# EAGLE design NFT-v1.1 (EAGLE 7.7.0)

## Sheet 1 of 5
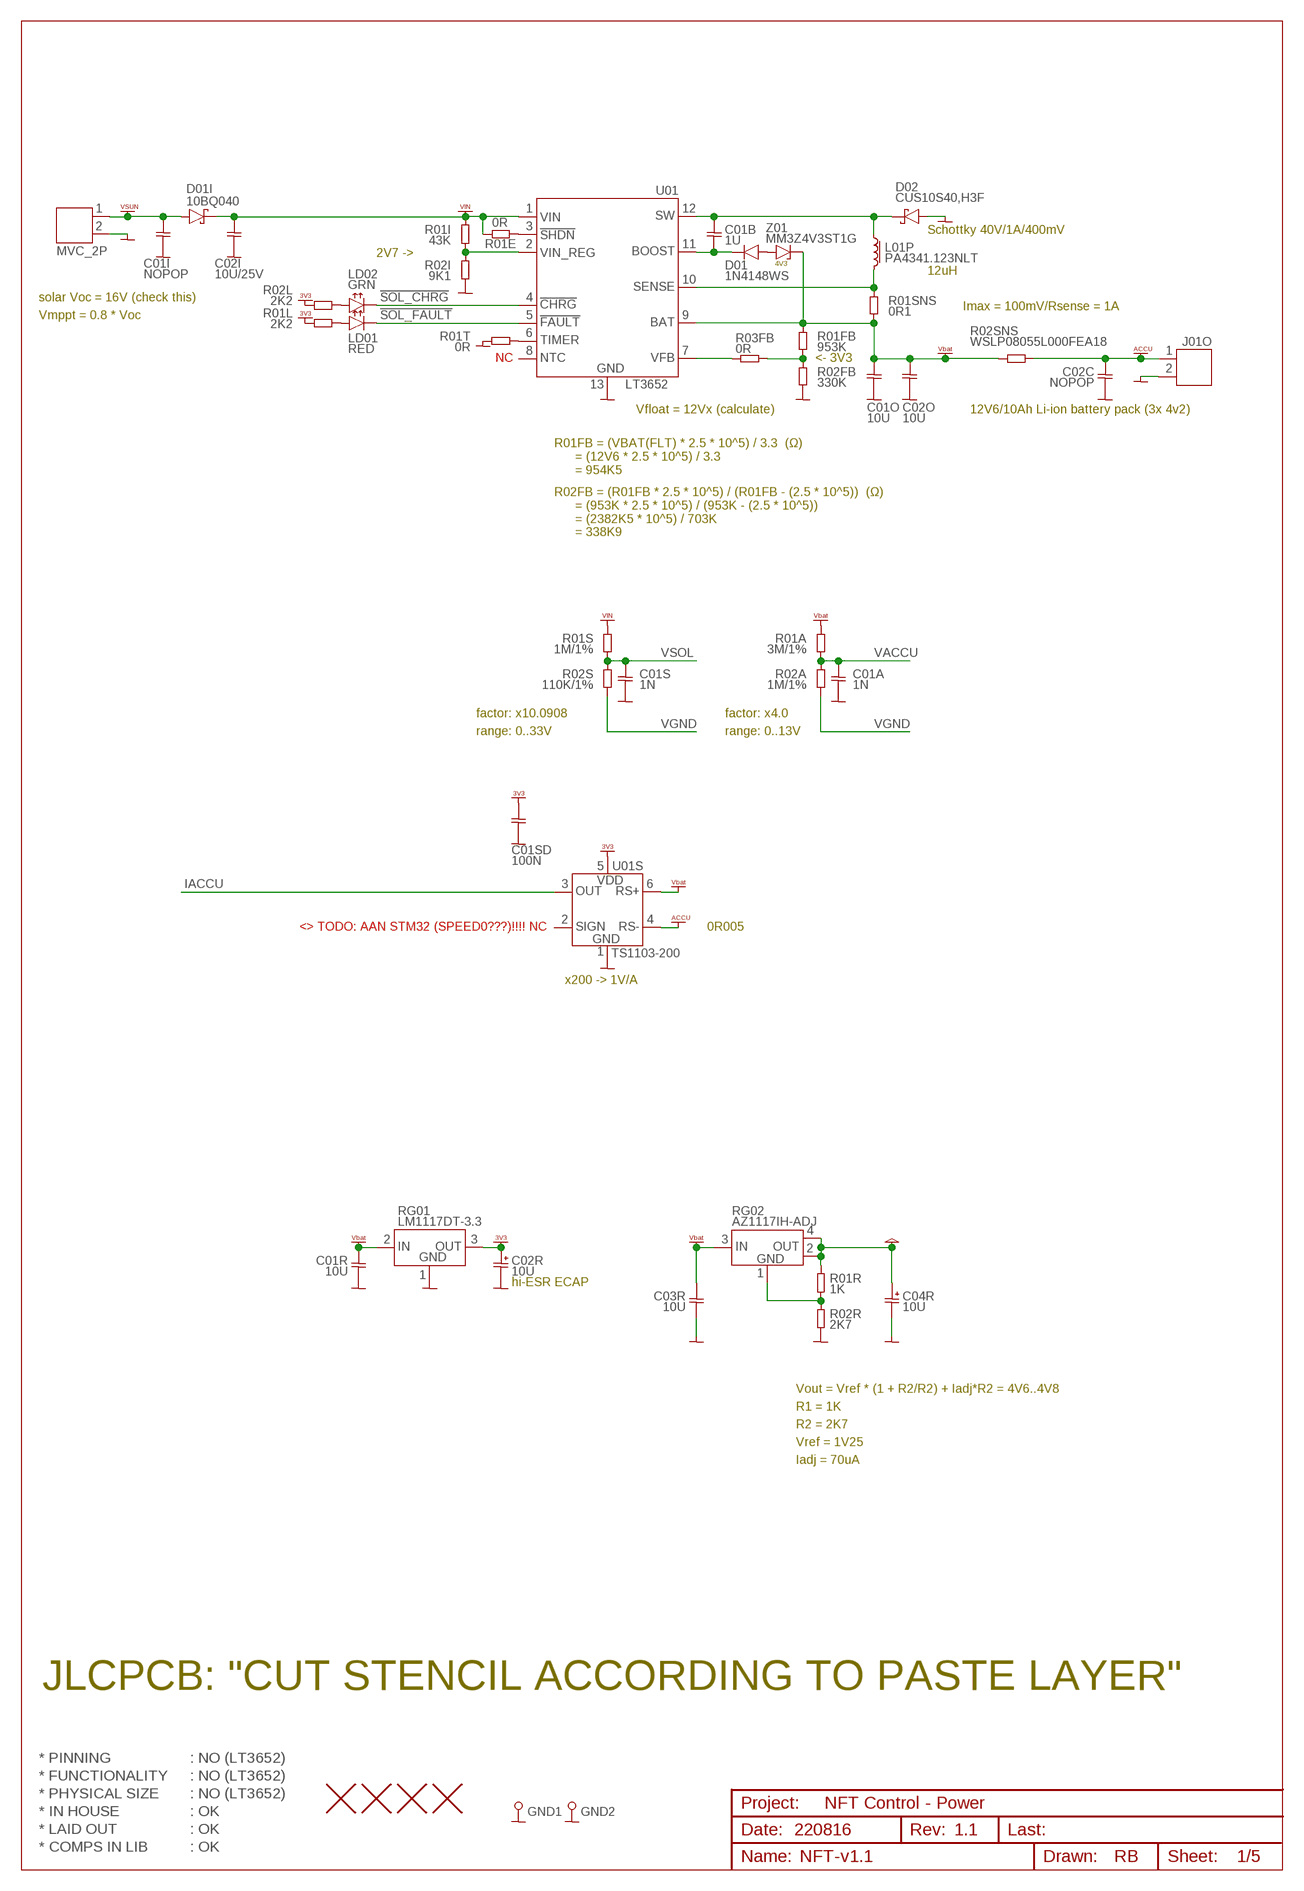
[diagram p0: schematic, sheet 1]

### Parts
C01A  1N  CAP0402  [CAP0402]
C01B  1U  CAP0402  [CAP0402]
C01I  NOPOP  CAP1812  [CAP1812]
C01O  10U  CAP0805  [CAP0805]
C01R  10U  CAP0603  [CAP0603]
C01S  1N  CAP0402  [CAP0402]
C01SD  100N  CAP0402  [CAP0402]
C02C  NOPOP  CAP1812  [CAP1812]
C02I  10U/25V  CAP0805  [CAP0805]
C02O  10U  CAP0805  [CAP0805]
C02R  10U  ECAP_SMA  [ECAP_SMA]
C03R  10U  CAP0603  [CAP0603]
C04R  10U  ECAP_SMA  [ECAP_SMA]
D01  1N4148WS  DIODE_1N4148WS  [DIODE_SOD323]
D01I  10BQ040  DIODE_10BQ030  [DIODE_SMB]
D02  CUS10S40,H3F  DIODE_SCHOTTKY_SOD323  [DIODE_SOD323]
GND1  PIN_TEST  [HOLE_PTH_0.8MM]
GND2  PIN_TEST  [HOLE_PTH_0.8MM]
H1  HOLE_NPTH_3.2MM  [HOLE_NPTH_3.2MM]
H2  HOLE_NPTH_3.2MM  [HOLE_NPTH_3.2MM]
H3  HOLE_NPTH_3.2MM  [HOLE_NPTH_3.2MM]
H4  HOLE_NPTH_3.2MM  [HOLE_NPTH_3.2MM]
J01I  MVC_2P  CON_PHOENIX_COMBICON_MCV_HEADER_2P  [CON_PHOENIX_COMBICON_MCV_HEADER_P]
J01O  CON_PHOENIX_COMBICON_MCV_HEADER_2P  [CON_PHOENIX_COMBICON_MCV_HEADER_P]
L01P  PA4341.123NLT  L_PA4341  [L_PA4341]
LD01  RED  LED_SMD_0402  [LED_SMD_0402]
LD02  GRN  LED_SMD_0402  [LED_SMD_0402]
R01A  3M/1%  RES0402  [RES0402]
R01E  0R  RES0402  [RES0402]
R01FB  953K  RES0402  [RES0402]
R01I  43K  RES0402  [RES0402]
R01L  2K2  RES0402  [RES0402]
R01R  1K  RES0402  [RES0402]
R01S  1M/1%  RES0402  [RES0402]
R01SNS  0R1  RES0603  [RES0603]
R01T  0R  RES0402  [RES0402]
R02A  1M/1%  RES0402  [RES0402]
R02FB  330K  RES0402  [RES0402]
R02I  9K1  RES0402  [RES0402]
R02L  2K2  RES0402  [RES0402]
R02R  2K7  RES0402  [RES0402]
R02S  110K/1%  RES0402  [RES0402]
R02SNS  WSLP08055L000FEA18  RES0805  [RES0805]
R03FB  0R  RES0402  [RES0402]
RG01  LM1117DT-3.3  [TO252]
RG02  AZ1117IH-ADJ  [SOT223]
U01  LT3652  [MSOP-12_GND]
U01S  TS1103-200  [SOT23-6]
Z01  MM3Z4V3ST1G  ZENER_SOD323  [ZENER_SOD323]

### Nets
!SOL_CHRG: LD02.C U01.4(4.!CHRG) ; also sheet 2
!SOL_FAULT: LD01.C U01.5(5.!FAULT)
ACCU: C02C.1 J01O.1 R02SNS.2 U01S.4(4.RS-) ; supply symbol labelled VACCU
BOOST: C01B.2 D01.C(-) U01.11(11.BOOST)
FB1: R01R.2 R02R.1 RG02.1(1.GND)
GND: C01A.2 C01I.2 C01O.2 C01R.2 C01S.2 C01SD.2 C02C.2 C02I.2 C02O.2 C02R.- C03R.2 C04R.- D02.A GND1.1 GND2.1 J01I.2 J01O.2 R01T.2 R02FB.1 R02I.1 R02R.2 RG01.1(1.GND) U01.13(GND_PAD) U01S.1(1.GND) ; also sheet 2,3,4,5
IACCU: U01S.3(3.OUT) ; also sheet 2
N$4: R03FB.2 U01.7(7.VFB)
N$5: LD01.A R01L.2
N$10: LD02.A R02L.2
N$25: R01T.1 U01.6(6.TIMER)
N$26: D01.A(+) Z01.A
N$27: R01E.1 U01.3(3.!SHDN)
SENSE: L01P.P$2 R01SNS.2 U01.10(10.SENSE)
SW: C01B.1 D02.C L01P.P$1 U01.12(12.SW)
VACCU: C01A.1 R01A.1 R02A.2 ; also sheet 2
VBAT: C01O.1 C01R.1 C02O.1 C03R.1 R01A.2 R01FB.2 R01SNS.1 R02SNS.1 RG01.2(2.IN) RG02.3(3.IN) U01.9(9.BAT) U01S.6(6.RS+) Z01.C ; also sheet 5
VCC: C04R.+ R01R.1 RG02.2(2.OUT) RG02.4(4.OUT) ; also sheet 5
VDD_3V3: C01SD.1 C02R.+ R01L.1 R02L.1 RG01.3(3.OUT) U01S.5(5.VDD) ; supply symbol labelled VCC_3V3 ; also sheet 2,3,4
VFB: R01FB.1 R02FB.2 R03FB.1
VGND: R02A.1 R02S.1 ; also sheet 2
VIN: C02I.1 D01I.C(-) R01E.2 R01I.2 R01S.2 U01.1(1.VIN)
VIN_REG: R01I.1 R02I.2 U01.2(2.VIN_REG)
VSOL: C01S.1 R01S.1 R02S.2 ; also sheet 2
VSUN: C01I.1 D01I.A(+) J01I.1
Unconnected: U01.8(8.NTC) U01S.2(2.SIGN)

### Notes on the sheet
- Schottky 40V/1A/400mV
- 2V7 ->
- 4V3
- 12uH
- solar Voc = 16V (check this)
- Imax = 100mV/Rsense = 1A
- Vmppt = 0.8 * Voc
- NC | <- 3V3
- Vfloat = 12Vx (calculate) | 12V6/10Ah Li-ion battery pack (3x 4v2)
- R01FB = (VBAT(FLT) * 2.5 * 10^5) / 3.3  (Ω)
        = (12V6 * 2.5 * 10^5) / 3.3
        = 954K5
- R02FB = (R01FB * 2.5 * 10^5) / (R01FB - (2.5 * 10^5))  (Ω)
        = (953K * 2.5 * 10^5) / (953K - (2.5 * 10^5))
        = (2382K5 * 10^5) / 703K
        = 338K9
- factor: x10.0908 | factor: x4.0
- range: 0..33V | range: 0..13V
- <> TODO: AAN STM32 (SPEED0???)!!!! NC | 0R005
- x200 -> 1V/A
- hi-ESR ECAP
- Vout = Vref * (1 + R2/R2) + Iadj*R2 = 4V6..4V8
- R1 = 1K
- R2 = 2K7
- Vref = 1V25
- Iadj = 70uA
- JLCPCB: "CUT STENCIL ACCORDING TO PASTE LAYER"
- * PINNING | : NO (LT3652)
- * FUNCTIONALITY | : NO (LT3652)
- * PHYSICAL SIZE | : NO (LT3652)
- NFT Control - Power
- * IN HOUSE | : OK
- * LAID OUT | : OK | 220816 | 1.1
- * COMPS IN LIB | : OK

## Sheet 2 of 5
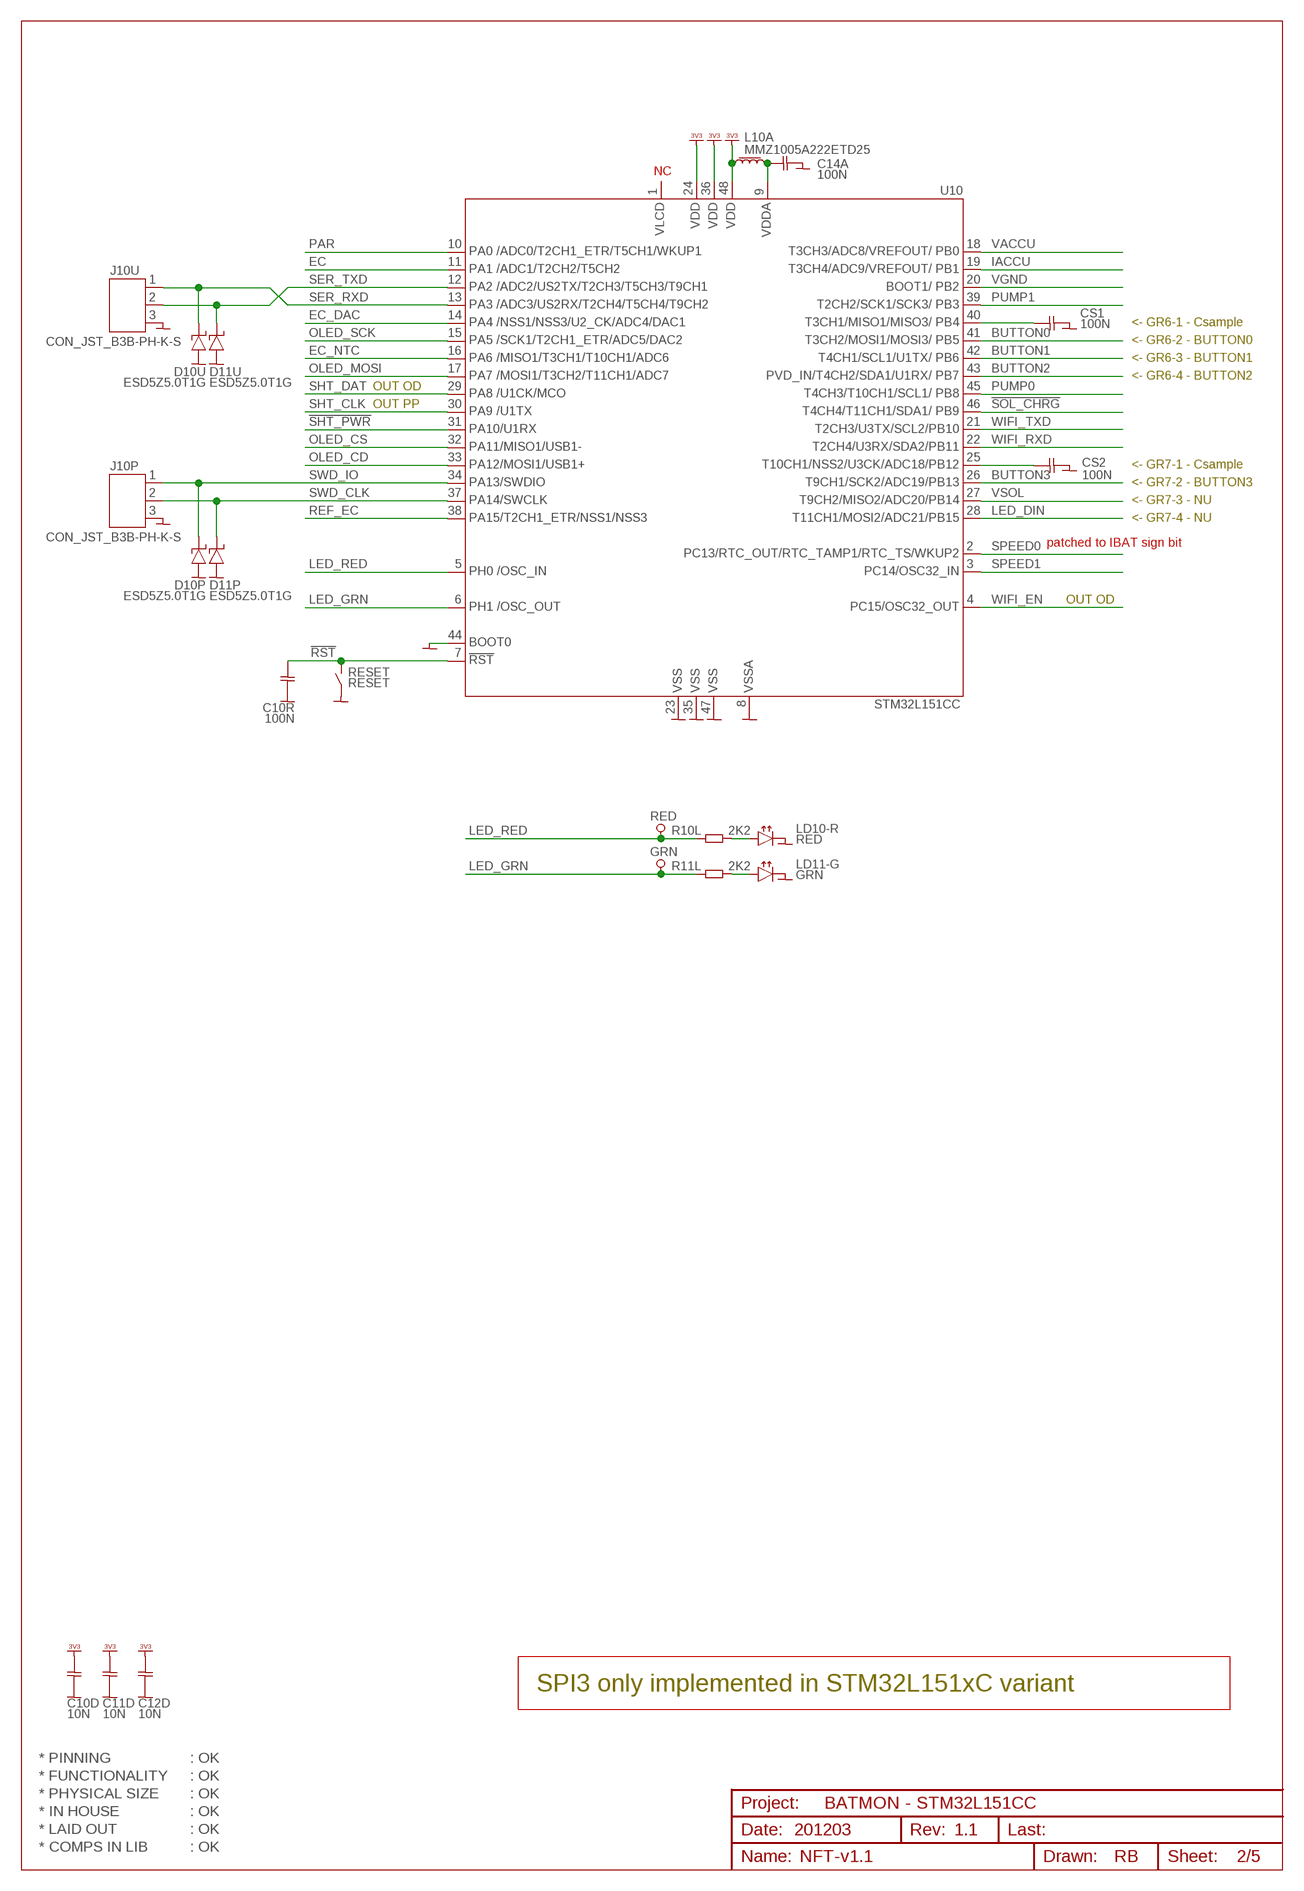
[diagram p1: schematic, sheet 2]

### Parts
C10D  10N  CAP0402  [CAP0402]
C10R  100N  CAP0402  [CAP0402]
C11D  10N  CAP0402  [CAP0402]
C12D  10N  CAP0402  [CAP0402]
C14A  100N  CAP0402  [CAP0402]
CS1  100N  CAP0402  [CAP0402]
CS2  100N  CAP0402  [CAP0402]
D10P  ESD5Z5.0T1G  DIODE_TVS_SOD523  [DIODE_SOD523]
D10U  ESD5Z5.0T1G  DIODE_TVS_SOD523  [DIODE_SOD523]
D11P  ESD5Z5.0T1G  DIODE_TVS_SOD523  [DIODE_SOD523]
D11U  ESD5Z5.0T1G  DIODE_TVS_SOD523  [DIODE_SOD523]
GRN  PIN_TEST_0.6MM  [HOLE_PTH_0.6MM]
J10P  CON_JST_B3B-PH-K-S  [CON_JST_B3B-PH-K-S]
J10U  CON_JST_B3B-PH-K-S  [CON_JST_B3B-PH-K-S]
L10A  MMZ1005A222ETD25  L_0402_LOSSY  [L_0402]
LD10-R  RED  LED_SMD_0402  [LED_SMD_0402]
LD11-G  GRN  LED_SMD_0402  [LED_SMD_0402]
R10L  2K2  RES0402  [RES0402]
R11L  2K2  RES0402  [RES0402]
RED  PIN_TEST_0.6MM  [HOLE_PTH_0.6MM]
RESET  RESET  SWITCH_PUSHBUTTON  [SWITCH_SMD_PBUTTON_2P]
U10  STM32L151CC  [LQFP48]

### Nets
!RST: C10R.1 RESET.1(1-2) U10.7(7.!RST)
!SHT_PWR: U10.31(31.PA10) ; also sheet 4
!SOL_CHRG: U10.46(46.PB9) ; also sheet 1
BUTTON0: U10.41(41.PB5) ; also sheet 3
BUTTON1: U10.42(42.PB6) ; also sheet 3
BUTTON2: U10.43(43.PB7) ; also sheet 3
BUTTON3: U10.26(26.PB13) ; also sheet 3
CSAMPLE: CS1.1 U10.40(40.PB4)
CSAMPLE1: CS2.1 U10.25(25.PB12)
EC: U10.11(11.PA1) ; also sheet 4
EC_DAC: U10.14(14.PA4) ; also sheet 4
EC_NTC: U10.16(16.PA6) ; also sheet 4
GND: C10D.2 C10R.2 C11D.2 C12D.2 C14A.2 CS1.2 CS2.2 D10P.A D10U.A D11P.A D11U.A J10P.3 J10U.3 LD10-R.C LD11-G.C RESET.2(3-4) U10.8(8.GND) U10.23(23.GND) U10.35(35.GND) U10.44(44.BOOT0) U10.47(47.GND) ; also sheet 1,3,4,5
IACCU: U10.19(19.PB1) ; also sheet 1
LED_DIN: U10.28(28.PB15) ; also sheet 5
LED_GRN: GRN.1 R11L.1 U10.6(6.OSC_OUT)
LED_RED: R10L.1 RED.1 U10.5(5.OSC_IN)
N$23: LD11-G.A R11L.2
N$39: LD10-R.A R10L.2
OLED_CD: U10.33(33.PA12) ; also sheet 3
OLED_CS: U10.32(32.PA11) ; also sheet 3
OLED_MOSI: U10.17(17.PA7) ; also sheet 3
OLED_SCK: U10.15(15.PA5) ; also sheet 3
PAR: U10.10(10.PA0) ; also sheet 4
PUMP0: U10.45(45.PB8) ; also sheet 5
PUMP1: U10.39(39.PB3) ; also sheet 5
REF_EC: U10.38(38.PA15) ; also sheet 4
SER_RXD: D10U.C J10U.1 U10.13(13.PA3)
SER_TXD: D11U.C J10U.2 U10.12(12.PA2)
SHT_CLK: U10.30(30.PA9) ; also sheet 4
SHT_DAT: U10.29(29.PA8) ; also sheet 4
SPEED0: U10.2(2.PC13) ; also sheet 5
SPEED1: U10.3(3.PC14) ; also sheet 5
SWD_CLK: D11P.C J10P.2 U10.37(37.PA14)
SWD_IO: D10P.C J10P.1 U10.34(34.PA13)
VACCU: U10.18(18.PB0) ; also sheet 1
VDD_3V3: C10D.1 C11D.1 C12D.1 L10A.1 U10.24(24.VDD) U10.36(36.VDD) U10.48(48.VDD) ; supply symbol labelled VCC_3V3 ; also sheet 1,3,4
VDDA: C14A.1 L10A.2 U10.9(9.VDD)
VGND: U10.20(20.PB2) ; also sheet 1
VSOL: U10.27(27.PB14) ; also sheet 1
WIFI_EN: U10.4(4.PC15) ; also sheet 3
WIFI_RXD: U10.22(22.PB11) ; also sheet 3
WIFI_TXD: U10.21(21.PB10) ; also sheet 3
Unconnected: U10.1(1.VDD)

### Notes on the sheet
- NC
- <- GR6-1 - Csample
- <- GR6-2 - BUTTON0
- <- GR6-3 - BUTTON1
- <- GR6-4 - BUTTON2
- OUT OD
- OUT PP
- <- GR7-1 - Csample
- <- GR7-2 - BUTTON3
- <- GR7-3 - NU
- <- GR7-4 - NU
- patched to IBAT sign bit
- OUT OD
- SPI3 only implemented in STM32L151xC variant
- * PINNING | : OK
- * FUNCTIONALITY | : OK
- * PHYSICAL SIZE | : OK
- BATMON - STM32L151CC
- * IN HOUSE | : OK
- * LAID OUT | : OK | 201203 | 1.1
- * COMPS IN LIB | : OK

## Sheet 3 of 5
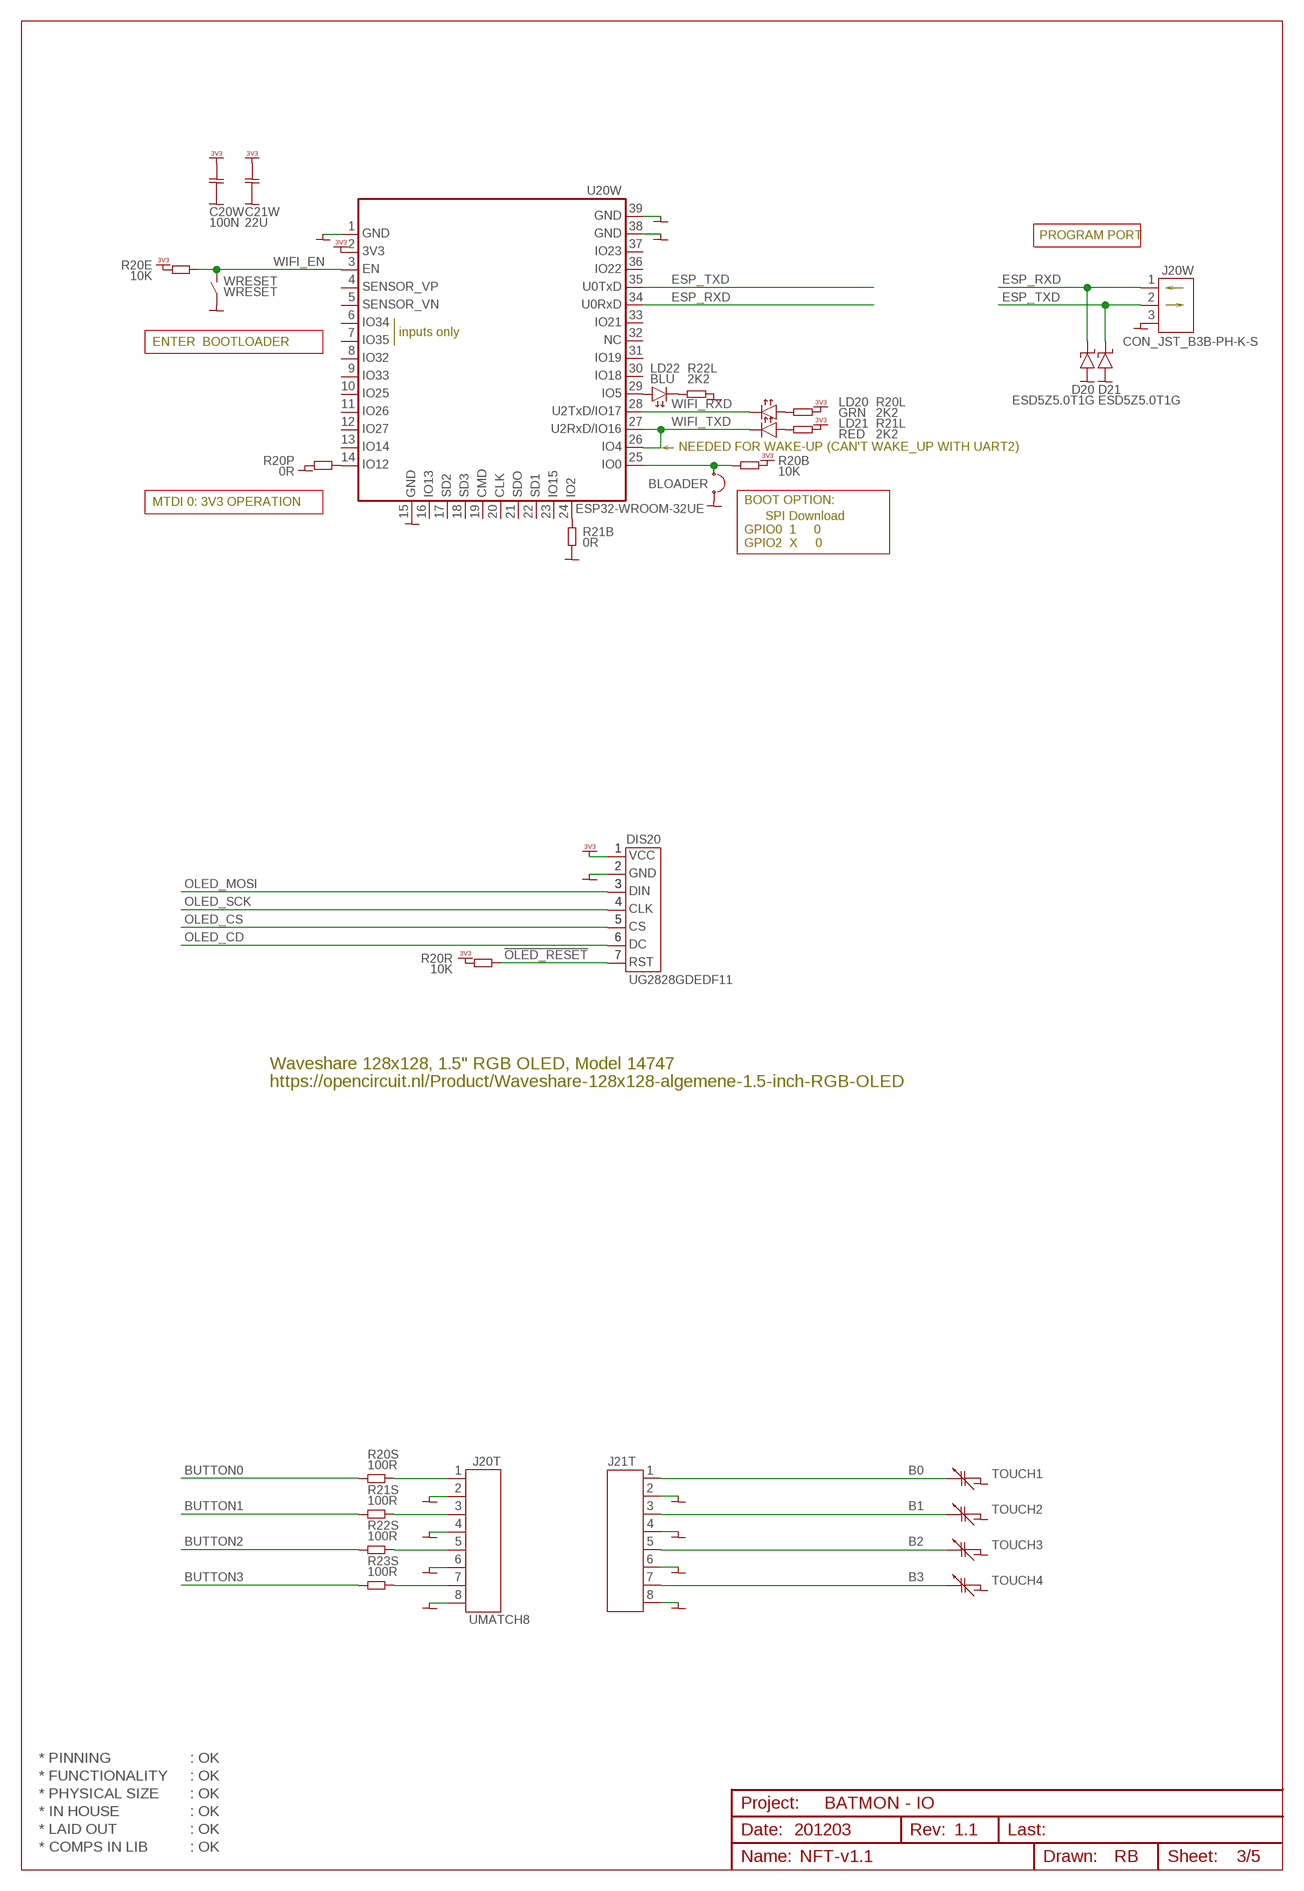
[diagram p2: schematic, sheet 3]

### Parts
BLOADER  GOLD2  [GOLD2]
C20W  100N  CAP0402  [CAP0402]
C21W  22U  CAP0805  [CAP0805]
D20  ESD5Z5.0T1G  DIODE_TVS_SOD523  [DIODE_SOD523]
D21  ESD5Z5.0T1G  DIODE_TVS_SOD523  [DIODE_SOD523]
DIS20  UG2828GDEDF11  WAVESHARE_1.5"OLED128X128  [WAVESHARE_1.5"OLED128X128]
J20T  UMATCH8  CON_MICROMATCH_8F-TOP  [CON_MICROMATCH_TOP_8F]
J20W  CON_JST_B3B-PH-K-S  [CON_JST_B3B-PH-K-S]
J21T  CON_MICROMATCH_8F_SMD-TOP  [CON_MICROMATCH_TOP_8F_SMD]
LD20  GRN  LED_SMD_0402  [LED_SMD_0402]
LD21  RED  LED_SMD_0402  [LED_SMD_0402]
LD22  BLU  LED_SMD_0402  [LED_SMD_0402]
R20B  10K  RES0402  [RES0402]
R20E  10K  RES0402  [RES0402]
R20L  2K2  RES0402  [RES0402]
R20P  0R  RES0402  [RES0402]
R20R  10K  RES0402  [RES0402]
R20S  100R  RES0402  [RES0402]
R21B  0R  RES0402  [RES0402]
R21L  2K2  RES0402  [RES0402]
R21S  100R  RES0402  [RES0402]
R22L  2K2  RES0402  [RES0402]
R22S  100R  RES0402  [RES0402]
R23S  100R  RES0402  [RES0402]
TOUCH1  CAP_TOUCH_ROUND_10MM_SINGLE  [CAP_TOUCH_ROUND_10MM_SINGLE]
TOUCH2  CAP_TOUCH_ROUND_10MM_SINGLE  [CAP_TOUCH_ROUND_10MM_SINGLE]
TOUCH3  CAP_TOUCH_ROUND_10MM_SINGLE  [CAP_TOUCH_ROUND_10MM_SINGLE]
TOUCH4  CAP_TOUCH_ROUND_10MM_SINGLE  [CAP_TOUCH_ROUND_10MM_SINGLE]
U20W  ESP32-WROOM-32UE  [ESP32-WROOM-32UE]
WRESET  WRESET  SWITCH_PUSHBUTTON  [SWITCH_SMD_PBUTTON_2P]

### Nets
!OLED_RESET: DIS20.7(7.RST) R20R.2
B0: J20T.1 J21T.1 R20S.2 TOUCH1.1
B1: J20T.3 J21T.3 R21S.2 TOUCH2.1
B2: J20T.5 J21T.5 R22S.2 TOUCH3.1
B3: J20T.7 J21T.7 R23S.2 TOUCH4.1
BUTTON0: R20S.1 ; also sheet 2
BUTTON1: R21S.1 ; also sheet 2
BUTTON2: R22S.1 ; also sheet 2
BUTTON3: R23S.1 ; also sheet 2
ESP_RXD: D20.C J20W.1 U20W.34(34.RXD0)
ESP_TXD: D21.C J20W.2 U20W.35(35.TXD0)
GND: BLOADER.2 C20W.2 C21W.2 D20.A D21.A DIS20.2(2.GND) J20T.2 J20T.4 J20T.6 J20T.8 J20W.3 J21T.2 J21T.4 J21T.6 J21T.8 R20P.2 R21B.2 R22L.1 TOUCH1.2 TOUCH2.2 TOUCH3.2 TOUCH4.2 U20W.1(1.GND) U20W.15(15.GND) U20W.38(38.GND) U20W.GND(39.GND) WRESET.2(3-4) ; also sheet 1,2,4,5
N$1: BLOADER.1 R20B.1 U20W.25(25.IO0)
N$2: LD20.A R20L.2
N$3: LD21.A R21L.2
N$16: R21B.1 U20W.24(24.IO2)
N$18: R20P.1 U20W.14(14.IO12)
N$24: LD22.C R22L.2
OLED_CD: DIS20.6(6.DC) ; also sheet 2
OLED_CS: DIS20.5(5.CS) ; also sheet 2
OLED_MOSI: DIS20.3(3.DIN) ; also sheet 2
OLED_SCK: DIS20.4(4.CLK) ; also sheet 2
VDD_3V3: C20W.1 C21W.1 DIS20.1(1.VCC) R20B.2 R20E.2 R20L.1 R20R.1 R21L.1 U20W.2(2.3V3) ; supply symbol labelled VCC_3V3 ; also sheet 1,2,4
WIFI_EN: R20E.1 U20W.3(3.EN) WRESET.1(1-2) ; also sheet 2
WIFI_LED: LD22.A U20W.29(29.IO5)
WIFI_RXD: LD20.C U20W.28(28.IO17) ; also sheet 2
WIFI_TXD: LD21.C U20W.26(26.IO4) U20W.27(27.IO16) ; also sheet 2
Unconnected: U20W.4(4.SENSOR_VP) U20W.5(5.SENSOR_VN) U20W.6(6.IO34) U20W.7(7.IO35) U20W.8(8.IO32) U20W.9(9.IO33) U20W.10(10.IO25) U20W.11(11.IO26) U20W.12(12.IO27) U20W.13(13.IO14) U20W.16(16.IO13) U20W.17(17.SD2) U20W.18(18.SD3) U20W.19(19.CMD) U20W.20(20.CLK) U20W.21(21.SDO) U20W.22(22.SD1) U20W.23(23.IO15) U20W.30(30.IO18) U20W.31(31.IO19) U20W.32(32.NC) U20W.33(33.IO21) U20W.36(36.IO22) U20W.37(37.IO23)

### Notes on the sheet
- PROGRAM PORT
- ENTER  BOOTLOADER
- NEEDED FOR WAKE-UP (CAN'T WAKE_UP WITH UART2)
- MTDI 0: 3V3 OPERATION | BOOT OPTION:
- SPI Download
  GPIO0  1     0
  GPIO2  X     0
- Waveshare 128x128, 1.5" RGB OLED, Model 14747
- https://opencircuit.nl/Product/Waveshare-128x128-algemene-1.5-inch-RGB-OLED
- * PINNING | : OK
- * FUNCTIONALITY | : OK
- * PHYSICAL SIZE | : OK
- BATMON - IO
- * IN HOUSE | : OK
- * LAID OUT | : OK | 201203 | 1.1
- * COMPS IN LIB | : OK

## Sheet 4 of 5
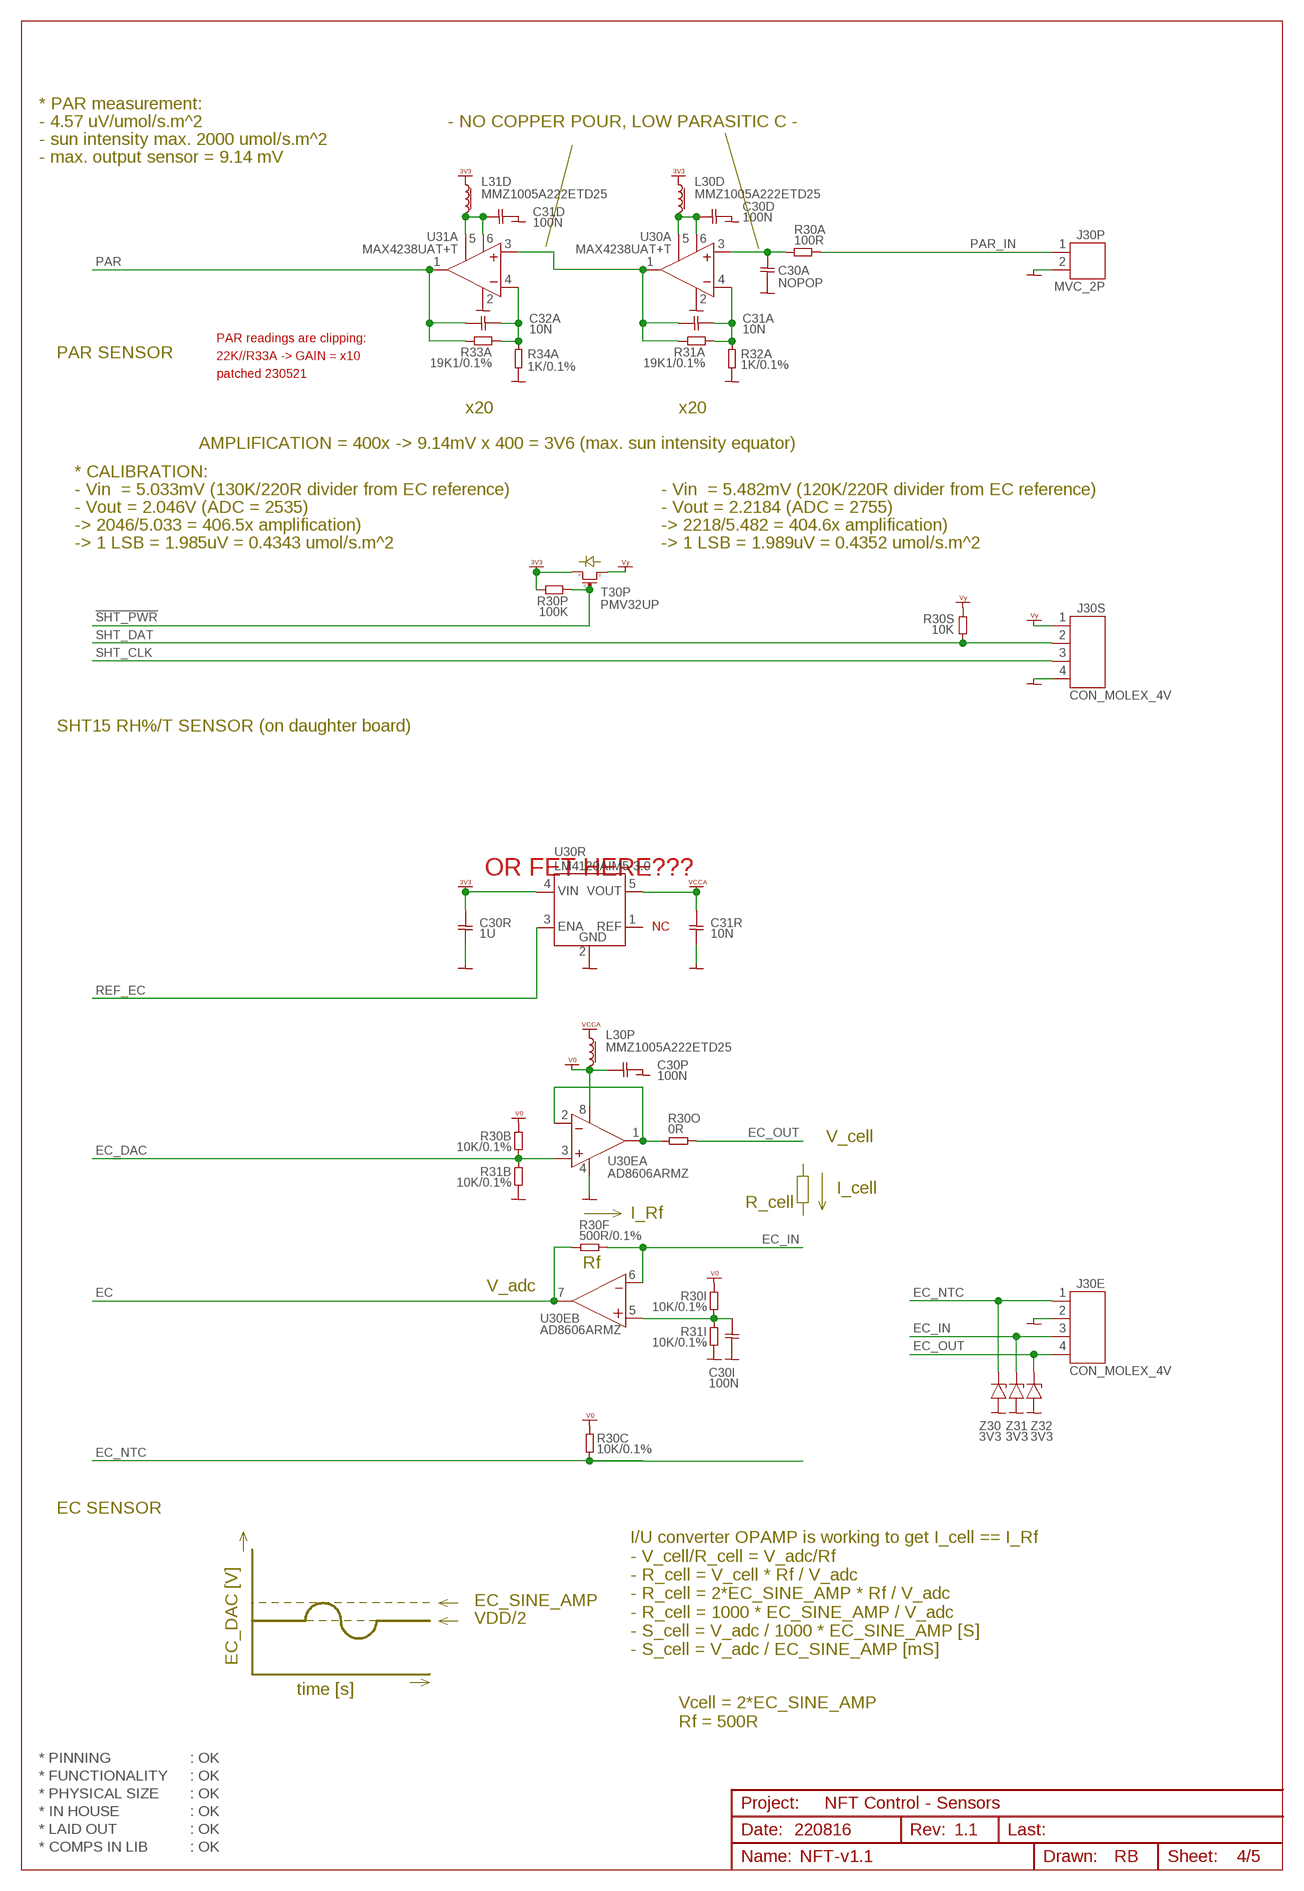
[diagram p3: schematic, sheet 4]

### Parts
C30A  NOPOP  CAP0402  [CAP0402]
C30D  100N  CAP0402  [CAP0402]
C30I  100N  CAP0402  [CAP0402]
C30P  100N  CAP0402  [CAP0402]
C30R  1U  CAP0402  [CAP0402]
C31A  10N  CAP0402  [CAP0402]
C31D  100N  CAP0402  [CAP0402]
C31R  10N  CAP0402  [CAP0402]
C32A  10N  CAP0402  [CAP0402]
J30E  CON_MOLEX_4V  [CON_MOLEX_4V]
J30P  MVC_2P  CON_PHOENIX_COMBICON_MCV_HEADER_2P  [CON_PHOENIX_COMBICON_MCV_HEADER_P]
J30S  CON_MOLEX_4V  [CON_MOLEX_4V]
L30D  MMZ1005A222ETD25  L_0402_LOSSY  [L_0402]
L30P  MMZ1005A222ETD25  L_0402_LOSSY  [L_0402]
L31D  MMZ1005A222ETD25  L_0402_LOSSY  [L_0402]
R30A  100R  RES0402  [RES0402]
R30B  10K/0.1%  RES0402  [RES0402]
R30C  10K/0.1%  RES0402  [RES0402]
R30F  500R/0.1%  RES0603  [RES0603]
R30I  10K/0.1%  RES0402  [RES0402]
R30O  0R  RES0402  [RES0402]
R30P  100K  RES0402  [RES0402]
R30S  10K  RES0402  [RES0402]
R31A  19K1/0.1%  RES0402  [RES0402]
R31B  10K/0.1%  RES0402  [RES0402]
R31I  10K/0.1%  RES0402  [RES0402]
R32A  1K/0.1%  RES0402  [RES0402]
R33A  19K1/0.1%  RES0402  [RES0402]
R34A  1K/0.1%  RES0402  [RES0402]
T30P  PMV32UP  PFET_SOT23  [PFET_SOT23]
U30A  MAX4238UAT+T  [SOT23-6]
U30E  AD8606ARMZ  [MSOP8]
U30R  LM4120AIM5-3.0  [SOT23-5]
U31A  MAX4238UAT+T  [SOT23-6]
Z30  3V3  ZENER_SOD80  [ZENER_SOD80]
Z31  3V3  ZENER_SOD80  [ZENER_SOD80]
Z32  3V3  ZENER_SOD80  [ZENER_SOD80]

### Nets
!SHT_PWR: R30P.2 T30P.1(G) ; also sheet 2
EC: R30F.2 U30E.7(B:7.OUT) ; also sheet 2
EC30_BUF: R30O.2 U30E.1(A:1.OUT) U30E.2(A:2.IN-)
EC_DAC: R30B.2 R31B.1 U30E.3(A:3.IN+) ; also sheet 2
EC_IN: J30E.3 R30F.1 U30E.6(B:6.IN-) Z31.2(C)
EC_NTC: J30E.1 R30C.2 Z30.2(C) ; also sheet 2
EC_OUT: J30E.4 R30O.1 Z32.2(C)
GND: C30A.1 C30D.2 C30I.1 C30P.2 C30R.2 C31D.2 C31R.2 J30E.2 J30P.2 J30S.4 R31B.2 R31I.2 R32A.2 R34A.2 U30A.2(2.V-) U30E.4(A:4.V-) U30R.2(2.GND) U31A.2(2.V-) Z30.1(A) Z31.1(A) Z32.1(A) ; also sheet 1,2,3,5
IMUXF: C30A.2 R30A.2 U30A.3(3.IN+)
N$6: C31D.1 L31D.2 U31A.5(5.!SHDN) U31A.6(6.V+)
N$8: C30I.2 R30I.2 R31I.1 U30E.5(B:5.IN+)
N$15: C30D.1 L30D.2 U30A.5(5.!SHDN) U30A.6(6.V+)
N$20: C32A.2 R33A.1 R34A.1 U31A.4(4.IN-)
N$21: C31A.1 R31A.2 U30A.1(1.OUT) U31A.3(3.IN+)
N$22: C31A.2 R31A.1 R32A.1 U30A.4(4.IN-)
PAR: C32A.1 R33A.2 U31A.1(1.OUT) ; also sheet 2
PAR_IN: J30P.1 R30A.1
REF_EC: U30R.3(3.ENA) ; also sheet 2
SHT_CLK: J30S.3 ; also sheet 2
SHT_DAT: J30S.2 R30S.2 ; also sheet 2
V0: C30P.1 L30P.2 R30B.1 R30C.1 R30I.1 U30E.8(A:8.V+)
VCCA: C31R.1 L30P.1 U30R.5(5.VOUT)
VDD_3V3: C30R.1 L30D.1 L31D.1 R30P.1 T30P.2(S) U30R.4(4.VIN) ; supply symbol labelled VCC_3V3 ; also sheet 1,2,3
VY: J30S.1 R30S.1 T30P.3(D)
Unconnected: U30R.1(1.REF)

### Notes on the sheet
- * PAR measurement:
- - 4.57 uV/umol/s.m^2 | - NO COPPER POUR, LOW PARASITIC C -
- - sun intensity max. 2000 umol/s.m^2
- - max. output sensor = 9.14 mV
- PAR readings are clipping:
- PAR SENSOR | 22K//R33A -> GAIN = x10
- patched 230521
- x20 | x20
- AMPLIFICATION = 400x -> 9.14mV x 400 = 3V6 (max. sun intensity equator)
- * CALIBRATION:
- - Vin  = 5.033mV (130K/220R divider from EC reference) | - Vin  = 5.482mV (120K/220R divider from EC reference)
- - Vout = 2.046V (ADC = 2535) | - Vout = 2.2184 (ADC = 2755)
- -> 2046/5.033 = 406.5x amplification) | -> 2218/5.482 = 404.6x amplification)
- -> 1 LSB = 1.985uV = 0.4343 umol/s.m^2 | -> 1 LSB = 1.989uV = 0.4352 umol/s.m^2
- SHT15 RH%/T SENSOR (on daughter board)
- OR FET HERE???
- NC
- V_cell
- I_cell
- R_cell
- I_Rf
- Rf
- V_adc
- EC SENSOR
- EC_SINE_AMP
- VDD/2
- EC_DAC [V]
- I/U converter OPAMP is working to get I_cell == I_Rf
   - V_cell/R_cell = V_adc/Rf 
   - R_cell = V_cell * Rf / V_adc          
   - R_cell = 2*EC_SINE_AMP * Rf / V_adc    
   - R_cell = 1000 * EC_SINE_AMP / V_adc
   - S_cell = V_adc / 1000 * EC_SINE_AMP [S]
   - S_cell = V_adc / EC_SINE_AMP [mS]
- time [s]
- Vcell = 2*EC_SINE_AMP
  Rf = 500R
- * PINNING | : OK
- * FUNCTIONALITY | : OK
- * PHYSICAL SIZE | : OK
- NFT Control - Sensors
- * IN HOUSE | : OK
- * LAID OUT | : OK | 220816 | 1.1
- * COMPS IN LIB | : OK

## Sheet 5 of 5
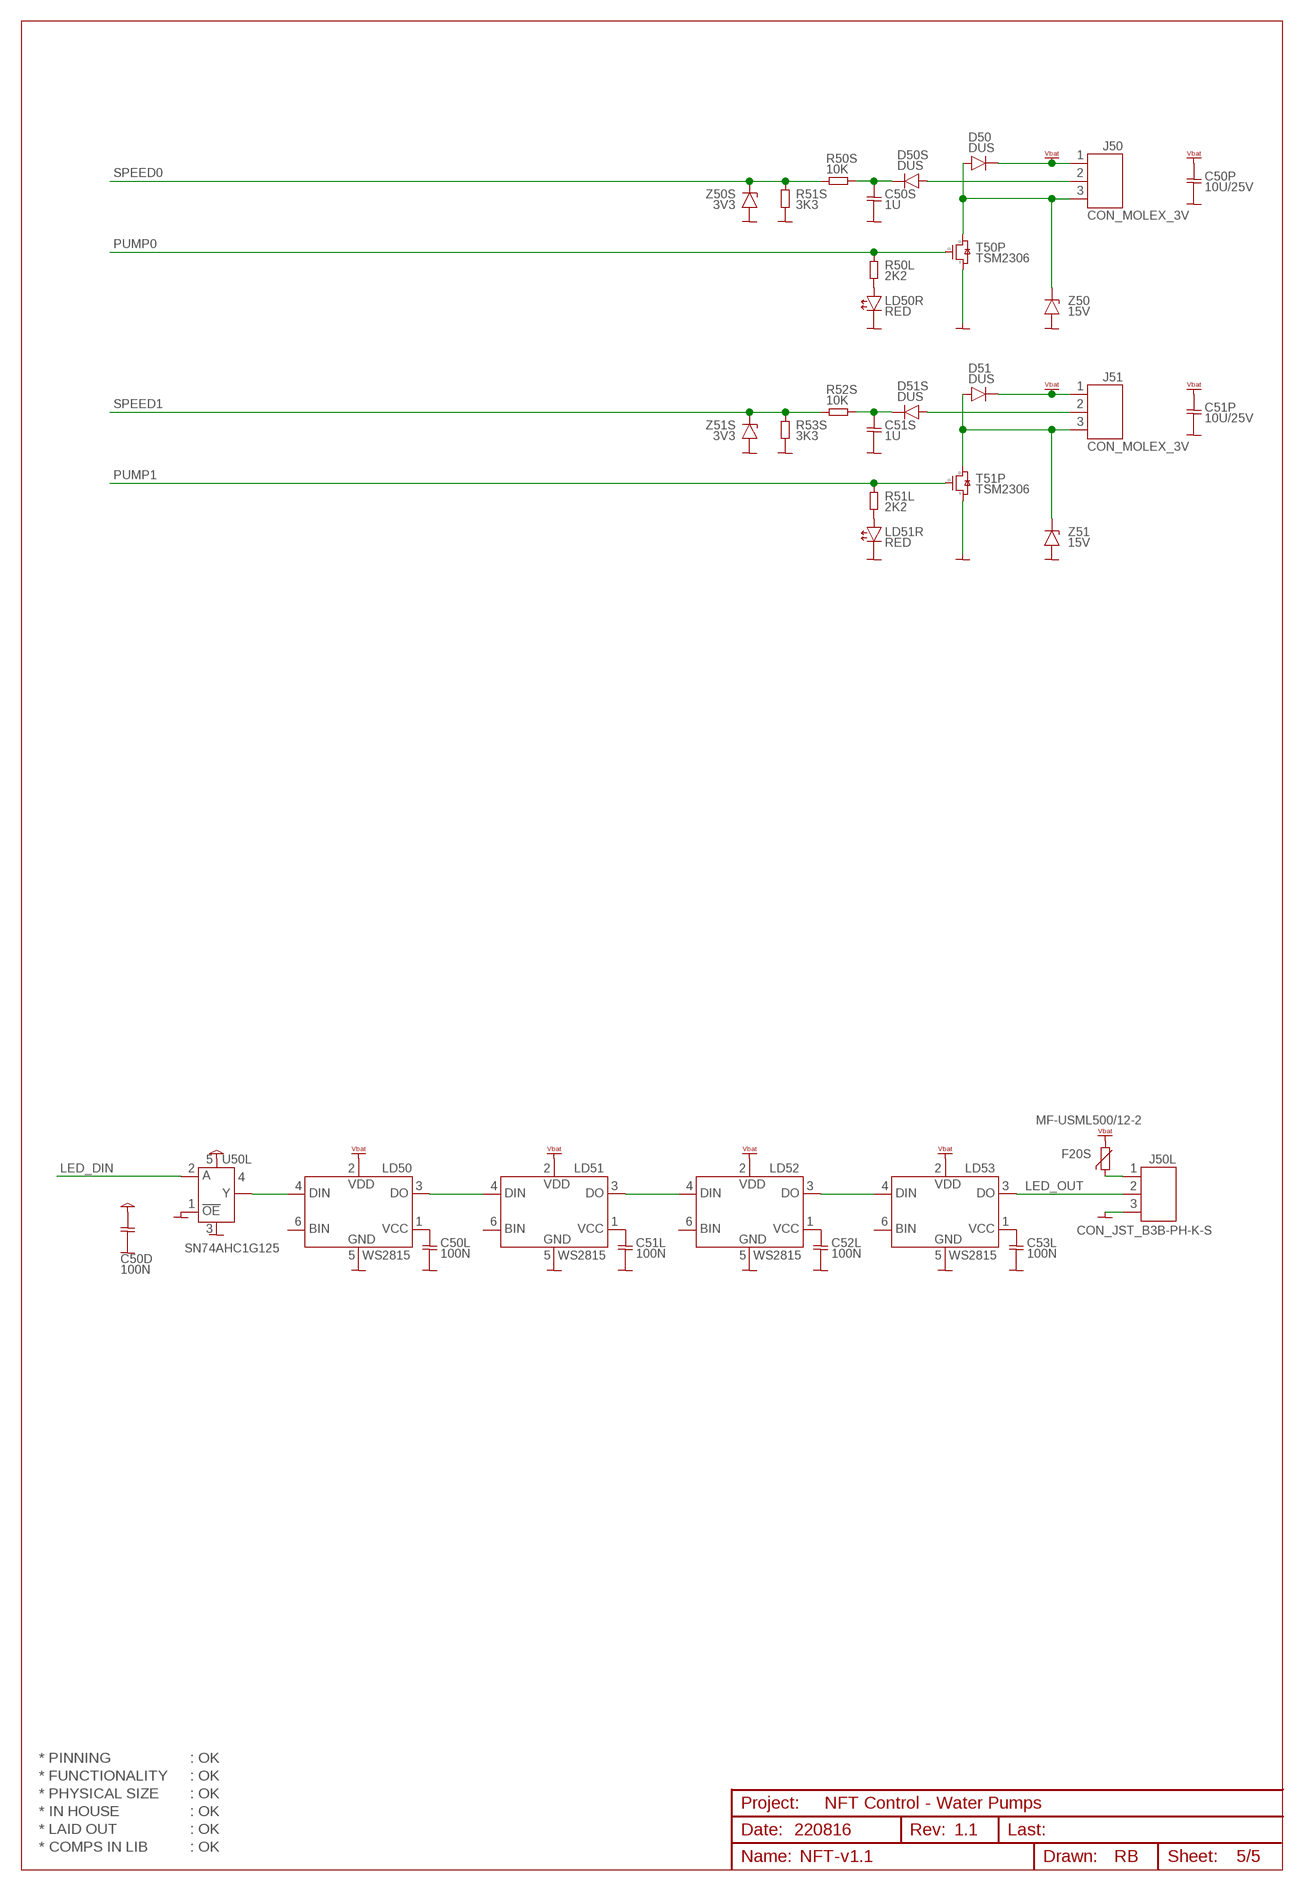
[diagram p4: schematic, sheet 5]

### Parts
C50D  100N  CAP0402  [CAP0402]
C50L  100N  CAP0402  [CAP0402]
C50P  10U/25V  CAP1210  [CAP1210]
C50S  1U  CAP0402  [CAP0402]
C51L  100N  CAP0402  [CAP0402]
C51P  10U/25V  CAP1210  [CAP1210]
C51S  1U  CAP0402  [CAP0402]
C52L  100N  CAP0402  [CAP0402]
C53L  100N  CAP0402  [CAP0402]
D50  DUS  DIODE_1N4148WS  [DIODE_SOD323]
D50S  DUS  DIODE_1N4148WS  [DIODE_SOD323]
D51  DUS  DIODE_1N4148WS  [DIODE_SOD323]
D51S  DUS  DIODE_1N4148WS  [DIODE_SOD323]
F20S  MF-USML500/12-2  PTC1210  [RES1210]
J50  CON_MOLEX_3V  [CON_MOLEX_3V]
J50L  CON_JST_B3B-PH-K-S  [CON_JST_B3B-PH-K-S]
J51  CON_MOLEX_3V  [CON_MOLEX_3V]
LD50  WS2815  [WS2815]
LD50R  RED  LED_SMD_0402  [LED_SMD_0402]
LD51  WS2815  [WS2815]
LD51R  RED  LED_SMD_0402  [LED_SMD_0402]
LD52  WS2815  [WS2815]
LD53  WS2815  [WS2815]
R50L  2K2  RES0402  [RES0402]
R50S  10K  RES0402  [RES0402]
R51L  2K2  RES0402  [RES0402]
R51S  3K3  RES0402  [RES0402]
R52S  10K  RES0402  [RES0402]
R53S  3K3  RES0402  [RES0402]
T50P  TSM2306  NFET_SOT23  [NFET_SOT23]
T51P  TSM2306  NFET_SOT23  [NFET_SOT23]
U50L  SN74AHC1G125  SN74AHC1G125DRLR  [SOT553-5]
Z50  15V  ZENER_SOD80  [ZENER_SOD80]
Z50S  3V3  ZENER_SOD80  [ZENER_SOD80]
Z51  15V  ZENER_SOD80  [ZENER_SOD80]
Z51S  3V3  ZENER_SOD80  [ZENER_SOD80]

### Nets
DI: LD50.4(4.DIN) U50L.4(4.Y)
GND: C50D.2 C50L.2 C50P.2 C50S.2 C51L.2 C51P.2 C51S.2 C52L.2 C53L.2 J50L.3 LD50.5(5.GND) LD50R.C LD51.5(5.GND) LD51R.C LD52.5(5.GND) LD53.5(5.GND) R51S.2 R53S.2 T50P.S(S2) T51P.S(S2) U50L.1(1.OE) U50L.3(3.GND) Z50.1(A) Z50S.1(A) Z51.1(A) Z51S.1(A) ; also sheet 1,2,3,4
LED_DIN: U50L.2(2.A) ; also sheet 2
LED_OUT: J50L.2 LD53.3(3.DO)
N$7: C50L.1 LD50.1(1.VCC)
N$9: C51L.1 LD51.1(1.VCC)
N$11: C52L.1 LD52.1(1.VCC)
N$12: C53L.1 LD53.1(1.VCC)
N$13: LD51R.A R51L.2
N$14: C50S.1 D50S.C(-) R50S.2
N$17: C51S.1 D51S.C(-) R52S.2
N$31: F20S.1 J50L.1
N$70: LD50R.A R50L.2
P0: D50.A(+) J50.3 T50P.D(D3) Z50.2(C)
P1: D51.A(+) J51.3 T51P.D(D3) Z51.2(C)
PUMP0: R50L.1 T50P.G(G1) ; also sheet 2
PUMP1: R51L.1 T51P.G(G1) ; also sheet 2
S0: D50S.A(+) J50.2
S1: D51S.A(+) J51.2
SPEED0: R50S.1 R51S.1 Z50S.2(C) ; also sheet 2
SPEED1: R52S.1 R53S.1 Z51S.2(C) ; also sheet 2
VBAT: C50P.1 C51P.1 D50.C(-) D51.C(-) F20S.2 J50.1 J51.1 LD50.2(2.VDD) LD51.2(2.VDD) LD52.2(2.VDD) LD53.2(2.VDD) ; also sheet 1
VCC: C50D.1 U50L.5(5.VDD) ; also sheet 1
X0: LD50.3(3.DO) LD51.4(4.DIN)
X1: LD51.3(3.DO) LD52.4(4.DIN)
X2: LD52.3(3.DO) LD53.4(4.DIN)
Unconnected: LD50.6(6.BIN) LD51.6(6.BIN) LD52.6(6.BIN) LD53.6(6.BIN)

### Notes on the sheet
- * PINNING | : OK
- * FUNCTIONALITY | : OK
- * PHYSICAL SIZE | : OK
- NFT Control - Water Pumps
- * IN HOUSE | : OK
- * LAID OUT | : OK | 220816 | 1.1
- * COMPS IN LIB | : OK

## Library data of the parts
BLOADER = 00-own_parts:GOLD2: Header, gold fingers, 0.1", 2x1
C01A C01B C01S C01SD C10D C10R C11D C12D C14A C20W C30A C30D C30I C30P C30R C31A C31D C31R C32A C50D C50L C50S C51L C51S C52L C53L CS1 CS2 = 00-own_parts:CAP0402: Capacitor, ceramic, 0402
C01I C02C = 00-own_parts:CAP1812: Capacitor, ceramic, 1812
C01O C02I C02O C21W = 00-own_parts:CAP0805: Capacitor, ceramic, 0805
C01R C03R = 00-own_parts:CAP0603: Capacitor, ceramic, 0603
C02R C04R = 00-own_parts:ECAP_SMA: Capacitor, tantalum, case A (1206)
C50P C51P = 00-own_parts:CAP1210: Capacitor, ceramic, 1210
D01 D50 D50S D51 D51S = 00-own_parts:DIODE_1N4148WS: Diode, 1N4148WS, high speed, 100V/350mA, SOD323
D01I = 00-own_parts:DIODE_10BQ030: Diode, Schottky, 10BQ030, 30V/1A, SMB
D02 = 00-own_parts:DIODE_SCHOTTKY_SOD323: Doide, Schottky, generic, SOD323
D10P D10U D11P D11U D20 D21 = 00-own_parts:DIODE_TVS_SOD523: Diode, transient surpressor, SOD523
DIS20 = 00-own_parts:WAVESHARE_1.5"OLED128X128: Display, OLED, RGB128x128, Vsupply: 3V3..5V, SPI
F20S = 00-own_parts:PTC: PTC multifuse. MF-RX160/72, I holding: 1.6A, I trip: 3.2A. F#:9350144
GND1 GND2 = 00-own_parts:PIN_TEST: Pin, test pad, hole 0.8mm, pad 1.6mm
GRN RED = 00-own_parts:PIN_TEST_0.6MM: Pin, test pad, hole 0.6mm, pad 1.0mm
H1-H4 = 00-own_parts:HOLE_NPTH_3.2MM: Hole, NPTH, 3.2mm
J01I J01O J30P = 00-own_parts:CON_PHOENIX_COMBICON_MCV_HEADER_2P: Connector, Phoenix, COMBICON MCV, 3.5mm, header, male pins, 2p, 1843619, F#370-4816
J10P J10U J20W J50L = 00-own_parts:CON_JST_B3B-PH-K-S: Connector, JST, 2.0mm pitch, 3p, top entry
J20T = 00-own_parts:CON_MICROMATCH_8F: Connector, PCB, micromatch, female, 8p, F# 148-593
J21T = 00-own_parts:CON_MICROMATCH_8F_SMD: Connector, PCB, micromatch, female, 8p, F# 148-593
J30E J30S = 00-own_parts:CON_MOLEX_4V: Connector, Molex, header, straight, 0.1", 4p, F#973-1164
J50 J51 = 00-own_parts:CON_MOLEX_3V: Connector, Molex, header, straight, 0.1", 3p, F#973-1156
L01P = 00-own_parts:L_PA4341: Inductor, case PA4341
L10A L30D L30P L31D = 00-own_parts:L_0402_LOSSY: Inductor, chip ferrite bead, lossy, 0402
LD01 LD02 LD10-R LD11-G LD20-LD22 LD50R LD51R = 00-own_parts:LED_SMD_0402: LED, SMD, 0402 (PICOLED)
LD50-LD53 = 00-own_parts:WS2815: LED, serial, 12V, 5050
R01A R01E R01FB R01I R01L R01R R01S R01SNS R01T R02A R02FB R02I R02L R02R R02S R02SNS R03FB R10L R11L R20B R20E R20L R20P R20R R20S R21B R21L R21S R22L R22S R23S R30A R30B R30C R30F R30I R30O R30P R30S R31A R31B R31I R32A R33A R34A R50L R50S R51L R51S R52S R53S = 00-own_parts:RES
RESET WRESET = 00-own_parts:SWITCH_PUSHBUTTON: Switch, push button, SPNO, MCTAEF, F# 160-5485
RG01 = 00-own_parts:LM1117DT-3.3: Regulator, 800mA, Vdrop: 1V, Vin_max: 20V, Vout: 3V3, TO252, F# 948-6275
RG02 = 00-own_parts:AZ1117IH-ADJ: Regulator,adjust/800mA, Vdrop: 1V2, Vin_max: 18V, Vout: 1V5 ≤ Vin-Vout ≤ 10V, SOT223, F#348-3089
T30P = 00-own_parts:PFET_SOT23: p-FET, generic, SOT23
T50P T51P = 00-own_parts:NFET_SOT23: n-FET, generic SOT23
TOUCH1-TOUCH4 = 00-own_parts:CAP_TOUCH_ROUND_10MM_SINGLE: Capacitor, touch sensor, single layer, round 10MM
U01 = 00-own_parts:LT3652: DC/DC converter, battery charger, solar, MMPT, 5..35V/2A, MSOP12-PAD
U01S = 00-own_parts:TS1103-200: Current sense amplifier, bi-directional, 200x gain, SOT23-6, F#243-7987
U10 = 00-own_parts:STM32L151CC: MCU, ultra-low power, ARM Cortex M3, 32-bit, 32 MHz, 256 kB Flash, 32 kB SRAM, 8 kB EEPROM, USB, ADC, DAC, LQFP48
U20W = 00-own_parts:ESP32-WROOM-32UE: Wireless module, WiFi & Bluetooth, external u.fl antenna
U30A U31A = 00-own_parts:MAX4238UAT+T: OPAMP, auto-zero, w. 100nA shutdown, rail-to-rail, Voffset = 0.1uV, Voffset drift: 10nV/°C, Ib = 100 pA, Vdd = 2V7..5V5, Idd = 0.6mA, SOT23-5
U30E = 00-own_parts:AD8606ARMZ: OPAMP, dual, single supply, precision low noise rail to rail op-amp, MSOP8, DK# AD8606ARMZ-R7CT-ND
U30R = 00-own_parts:LM4120AIM5-3.0: Reference, series, with enable, 3V00, SOT23-5
U50L = 00-own_parts:SN74AHC1G125DRLR: Buffer, non-inverting, inverted enable, Hi-Z output, single gate, SOT553-5, F#300-6124
Z01 = 00-own_parts:ZENER_SOD323: Zener, generic SOD323
Z30-Z32 Z50 Z50S Z51 Z51S = 00-own_parts:ZENER_SOD80: Zener, generic SOD80

## Board
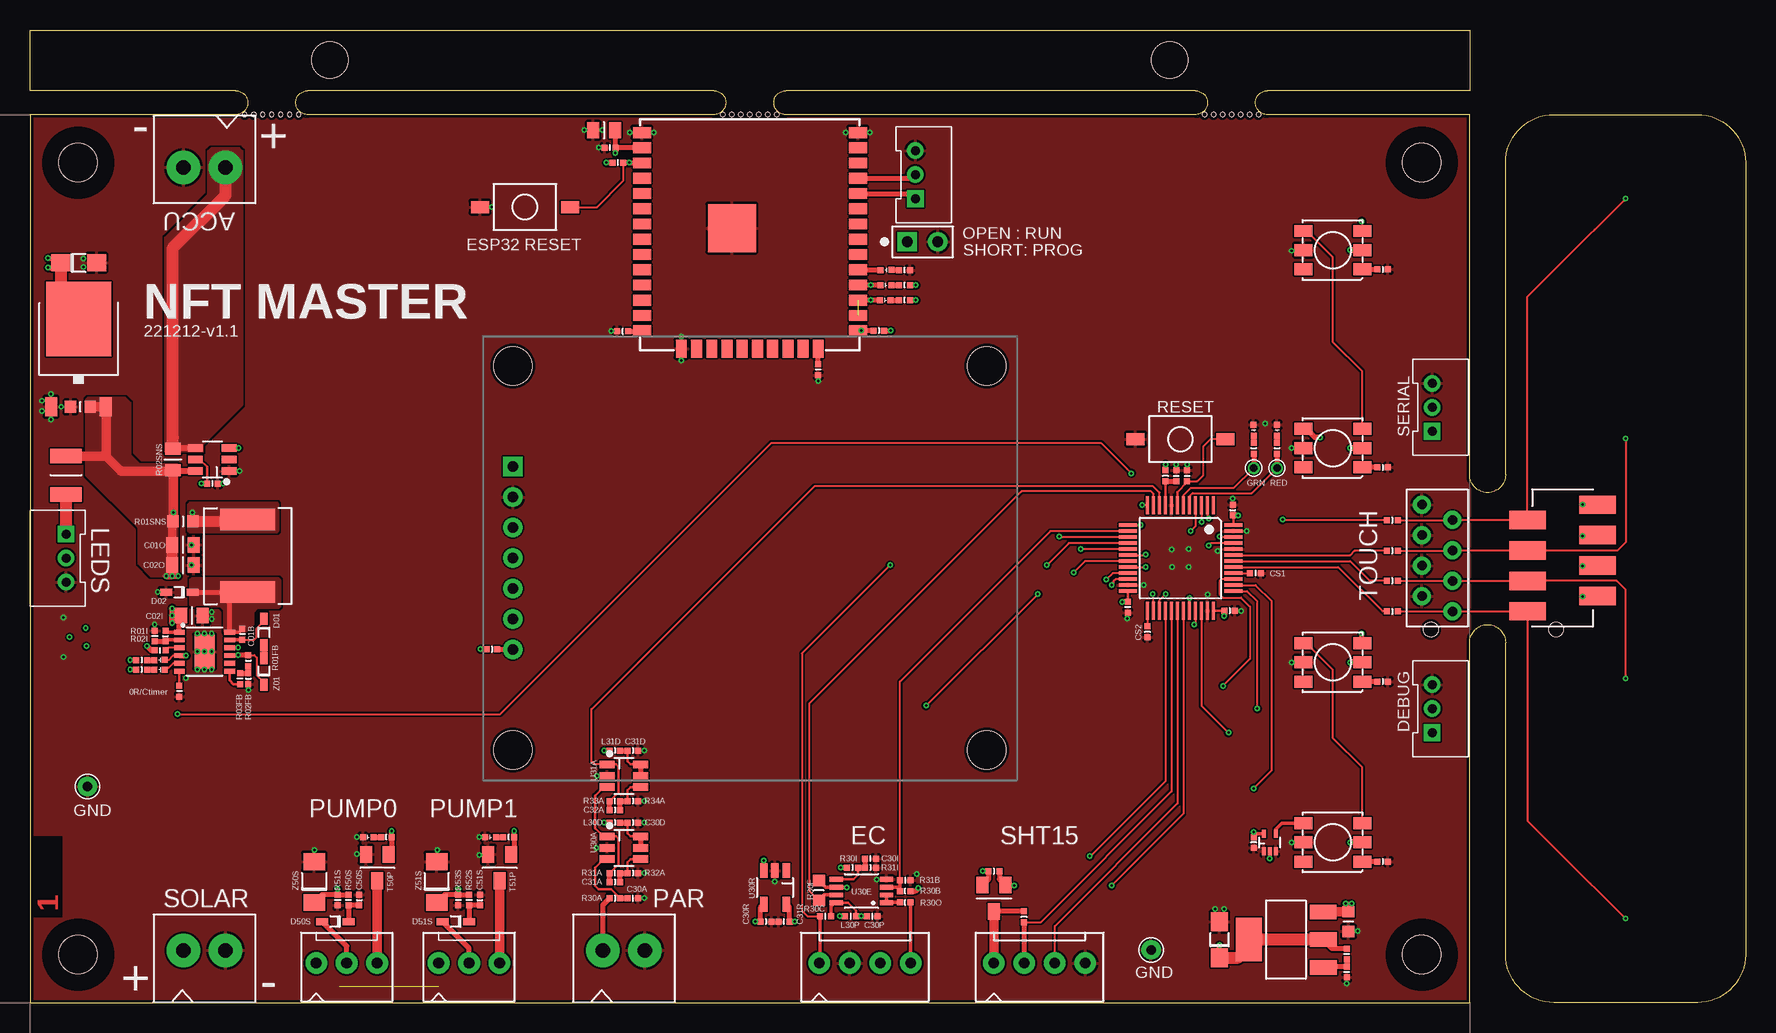
[diagram p5: board, top side]
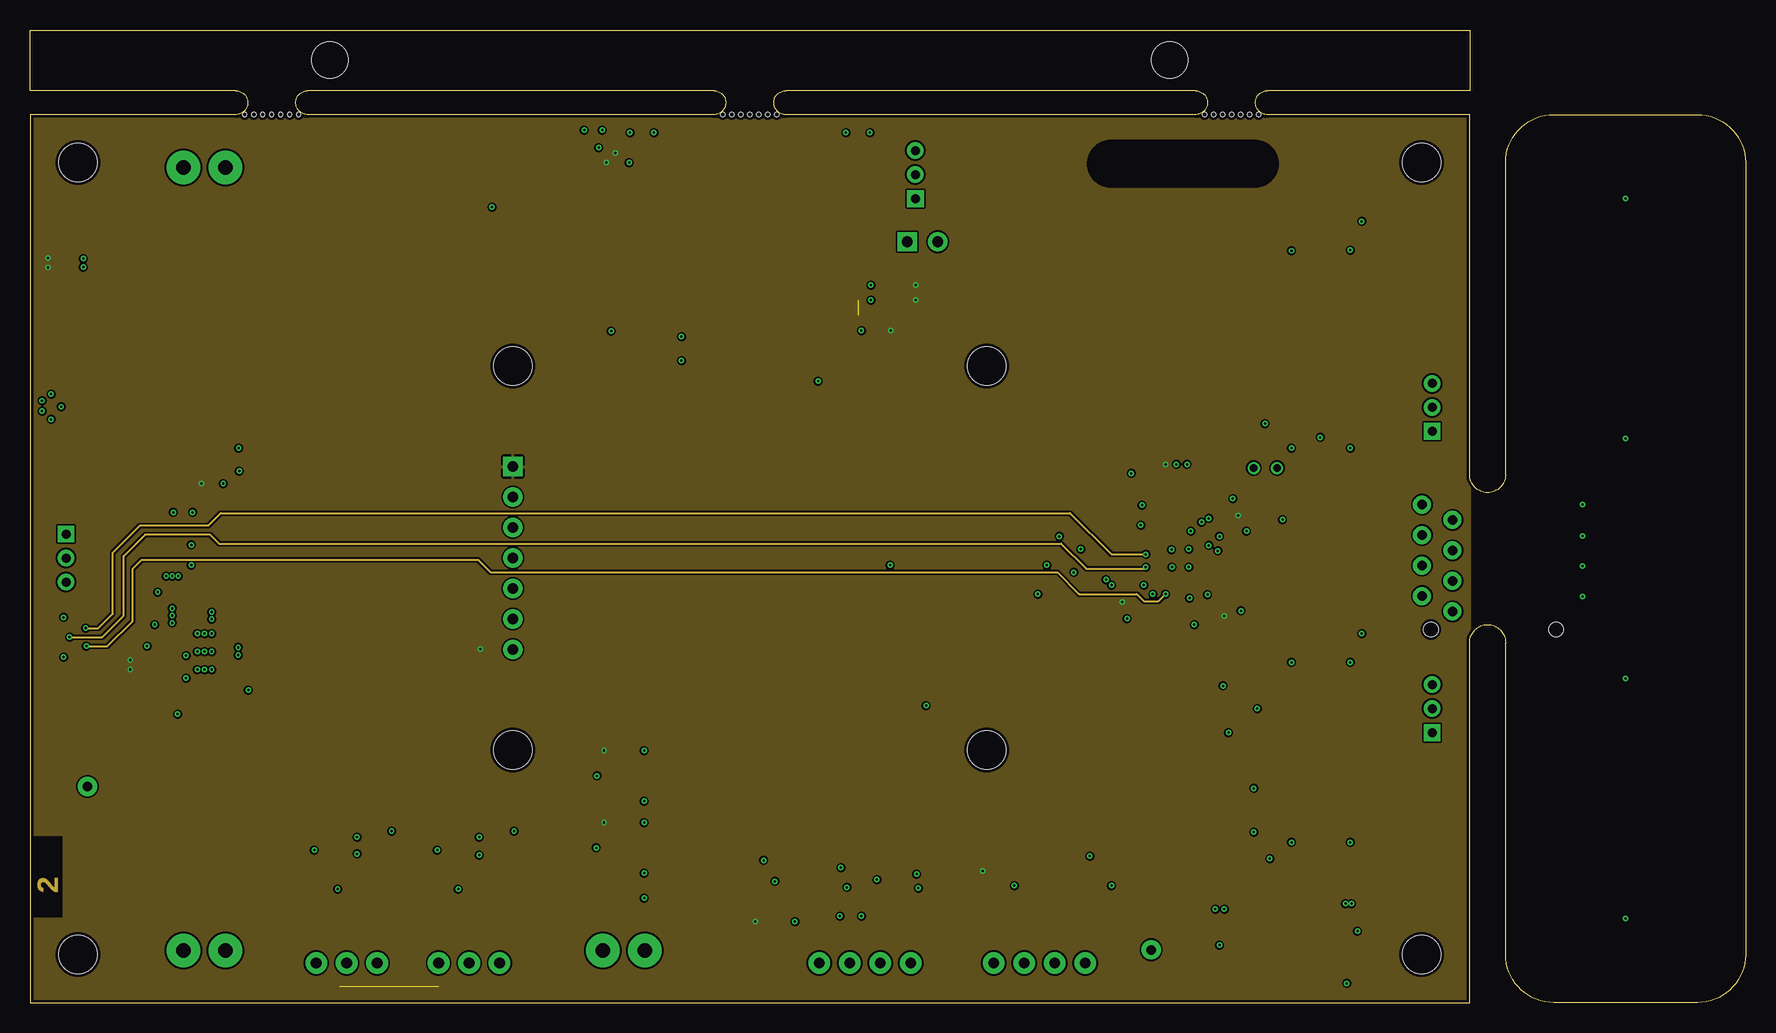
[diagram p6: board, inner layer Route2]
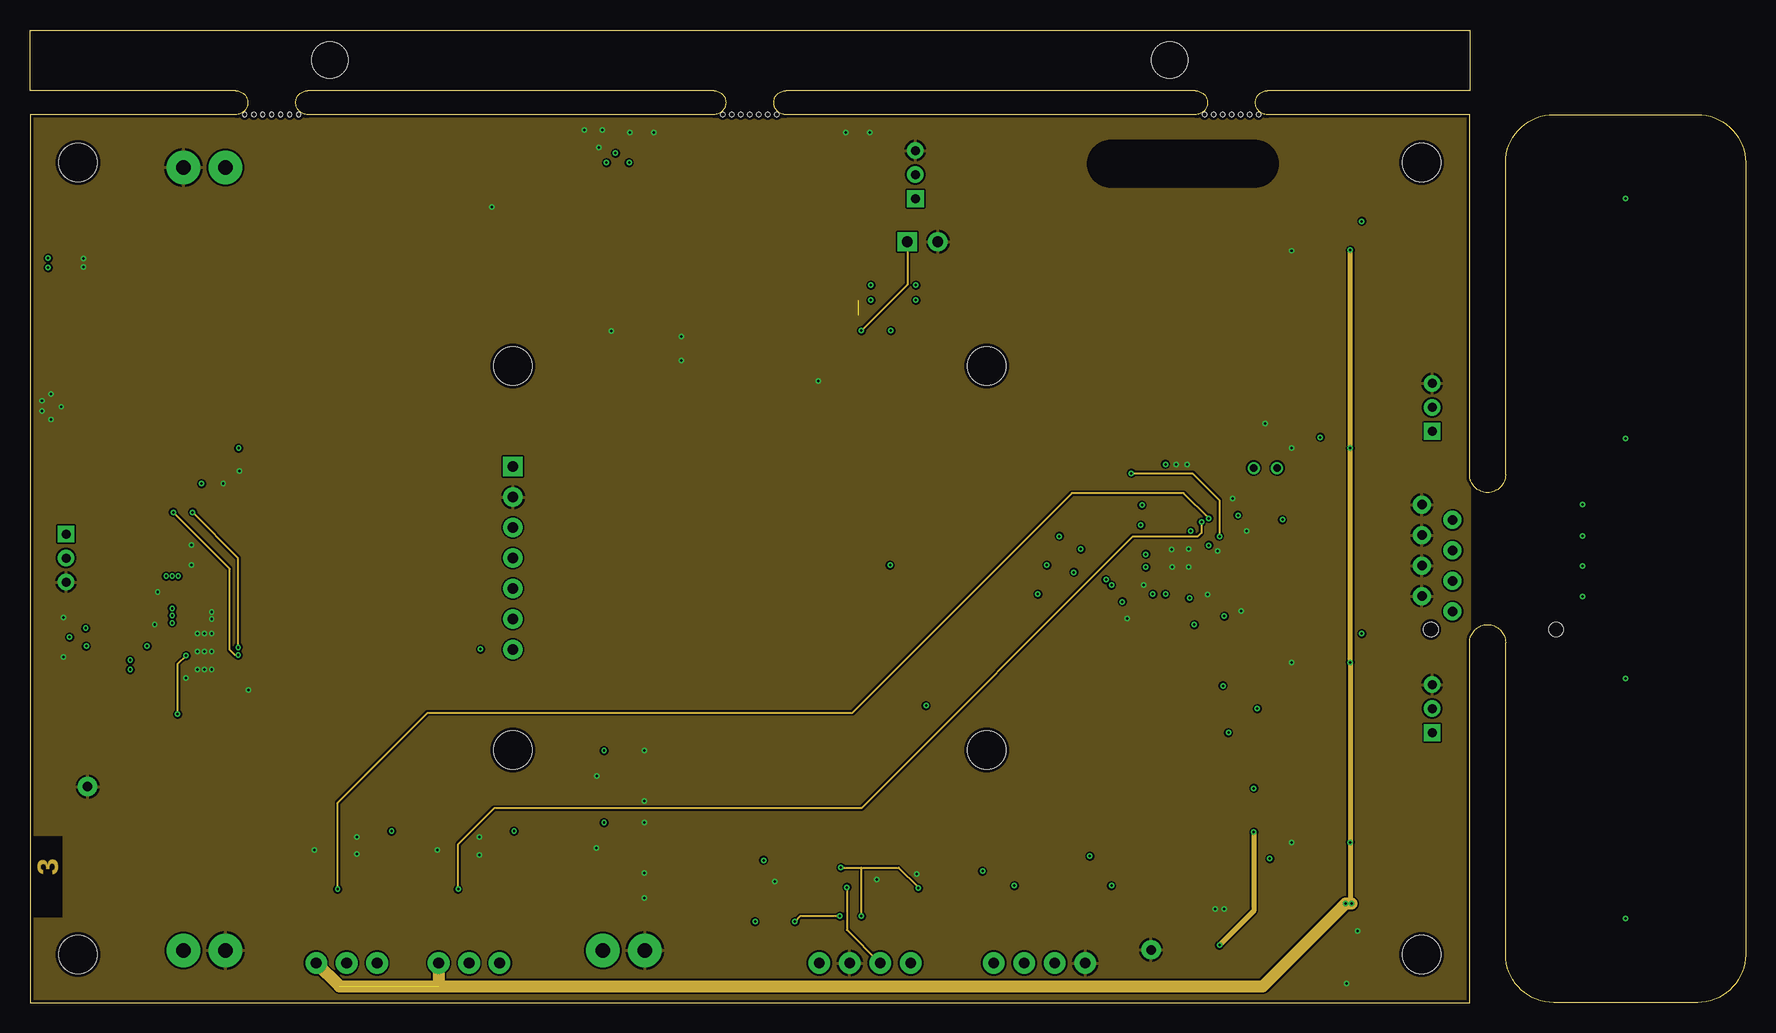
[diagram p7: board, inner layer Route15]
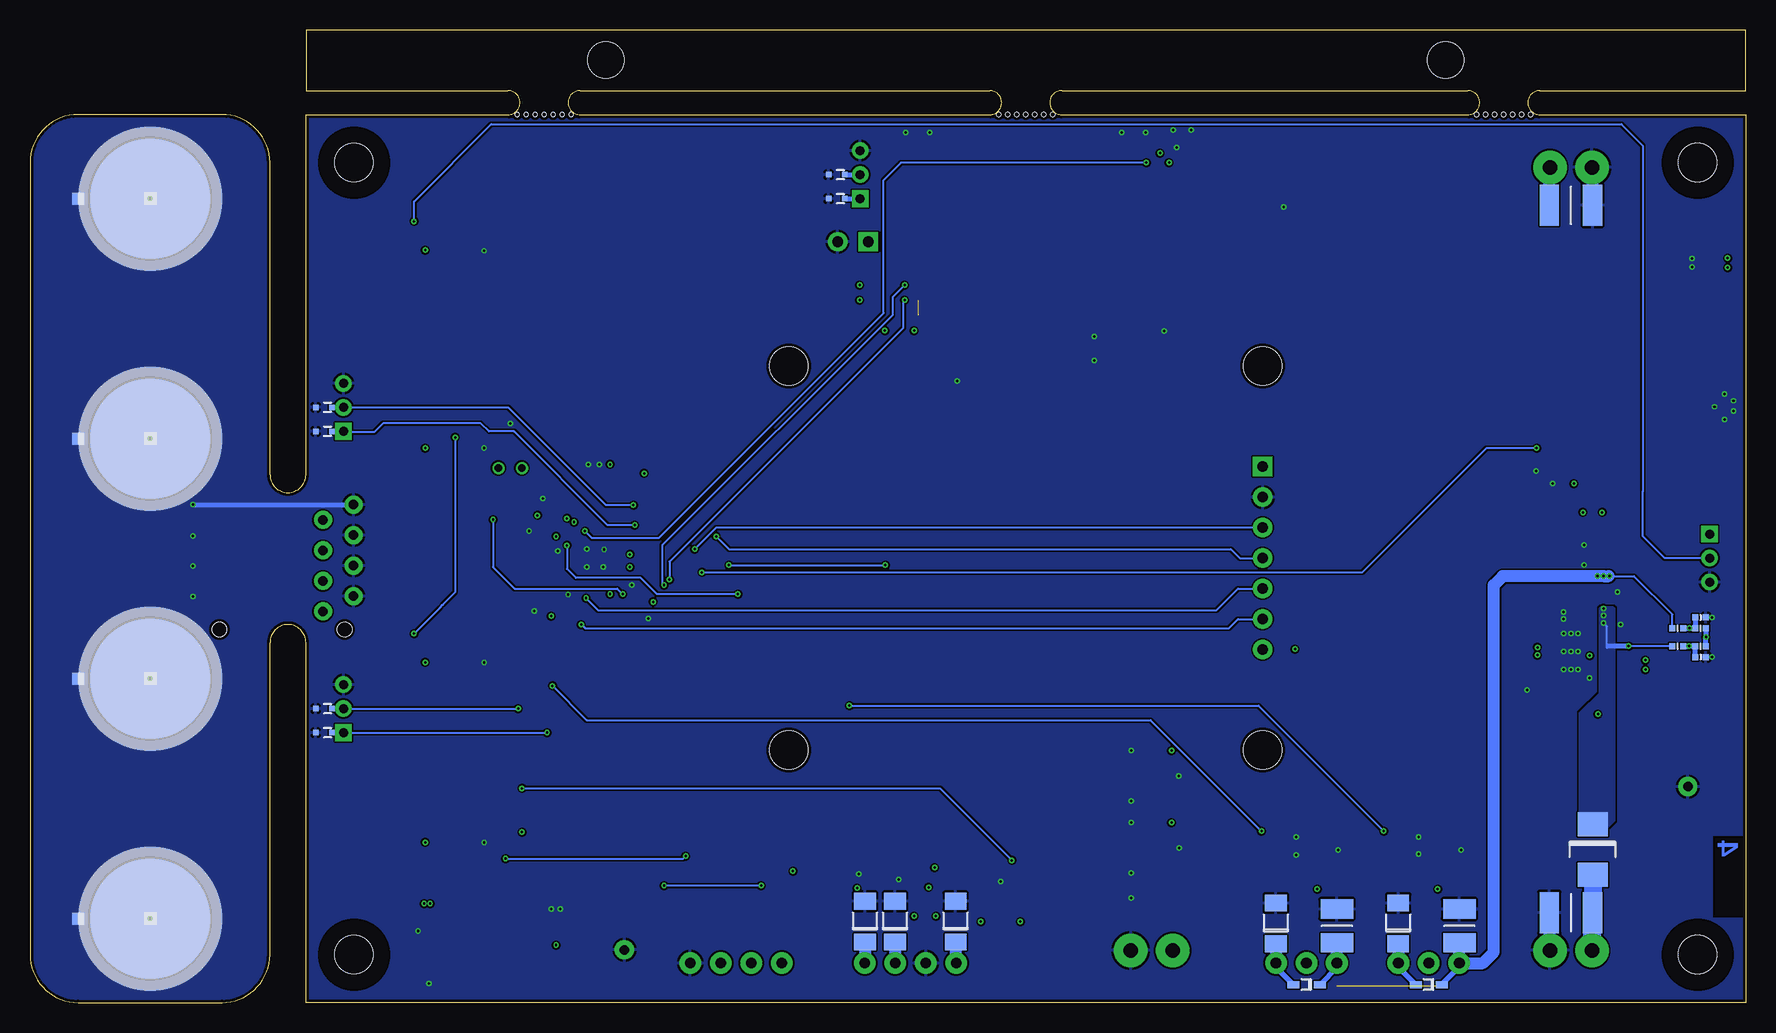
[diagram p8: board, bottom side, seen from below]

Size 143 x 81.05 mm. Coordinates in mm from the lower left corner, seen from the top.
Outline: 103.15,76 120,76 120,81.05 0,81.05 0,76 17.15,76
Outline: 97.15,76 63,76
Outline: 57,76 23.15,76
Outline: 103.15,74 120,74 120,44 arc180 123,44 123,70 arc-90 127,74 139,74 arc-90 143,70 143,4 arc-90 139,0 127,0 arc-90 123,4 123,30 arc180 120,30 120,0 0,0 0,74 17.15,74
Outline: 97.15,74 62.85,74
Outline: 57,74 23.15,74
Copper layers (1*2*15*16): Top 0.018mm / dielectric 0.36mm / Route2 0.035mm / dielectric 0.71mm / Route15 0.035mm / dielectric 0.36mm / Bottom 0.018mm
Design rules "default": minimum track width 0.15mm, minimum drill 0.2mm, track to track 0.15mm, track to pad 0.15mm, pad to pad 0.15mm, via to via 0.15mm, smd to smd 0mil, copper to edge 0.25mm, drill to drill 0.3mm, minimum pad ring 0.2mm, minimum via ring 0.125mm, stop-mask expansion 0.1mm, vias tented up to drill 0.25mm, thermal gap 0.2mm

### Footprints (pad centres in the part's own frame; a part is rotated, then mirrored left to right if it is on the bottom)
GOLD2 = drill 0.9 pad 1.6 square: 1 -1.27,0 | drill 0.9 pad 1.6: 2 1.27,0
CAP0402 = smd 0.5 x 0.5: 1 -0.45,0; 2 0.45,0
CAP1812 = smd 1.6 x 3.4: 1 -1.8,0; 2 1.8,0
CAP0805 = smd 1 x 1.3: 1 -0.9,0; 2 0.9,0
CAP0603 = smd 0.95 x 1: 1 -0.821,0.002; 2 0.822,0
ECAP_SMA = smd 1.6 x 1.4: + -1.5,0; - 1.5,0
CAP1210 = smd 1.6 x 2.7: 1 -1.4,0; 2 1.4,0
DIODE_SOD323 = smd 1 x 0.6: A 1.1,0; C -1.1,0
DIODE_SMB = smd 2 x 2.5: A -2.1,0; C 2.1,0
DIODE_SOD523 = smd 0.45 x 0.45: A 0.675,0; C -0.675,0
WAVESHARE_1.5"OLED128X128 = drill 0.9 pad 1.6 square: 1 -19.75,7.62 | drill 0.9 pad 1.6: 2 -19.75,5.08; 3 -19.75,2.54; 4 -19.75,0; 5 -19.75,-2.54; 6 -19.75,-5.08; 7 -19.75,-7.62 | hole 3.2: -19.75,-16; -19.75,16; 19.75,16; 19.75,-16
RES1210 = smd 1.2 x 2.6: 1 -1.6,0; 2 1.6,0
HOLE_PTH_0.8MM = drill 0.8 pad 1.6: 1 0,0
HOLE_PTH_0.6MM = drill 0.6 pad 1: 1 0,0
HOLE_NPTH_3.2MM = hole 3.2: 0,0
CON_PHOENIX_COMBICON_MCV_HEADER_P = drill 1.2 pad 2.8: 1 -1.75,0; 2 1.75,0
CON_JST_B3B-PH-K-S = drill 0.75 pad 1.4 square: 1 -2,0 | drill 0.75 pad 1.4: 2 0,0; 3 2,0
CON_MICROMATCH_TOP_8F = drill 0.8 pad 1.5: 1 -4.445,-1.27; 2 -3.175,1.27; 3 -1.905,-1.27; 4 -0.635,1.27; 5 0.635,-1.27; 6 1.905,1.27; 7 3.175,-1.27; 8 4.445,1.27 | hole 1.2: -5.945,0.53
CON_MICROMATCH_TOP_8F_SMD = smd 1.524 x 3.048: 1 -4.445,2.921; 2 -3.175,-2.921; 3 -1.905,2.921; 4 -0.635,-2.921; 5 0.635,2.921; 6 1.905,-2.921; 7 3.175,2.921; 8 4.445,-2.921 | hole 1.2: -5.945,0.53
CON_MOLEX_4V = drill 0.9 pad 1.8: 1 -3.81,0; 2 -1.27,0; 3 1.27,0; 4 3.81,0
CON_MOLEX_3V = drill 0.9 pad 1.8: 1 -2.54,0; 2 0,0; 3 2.54,0
L_PA4341 = smd 1.8 x 4.6: P$1 -3,0; P$2 3.05,0
L_0402 = smd 0.5 x 0.5: 1 -0.45,0; 2 0.45,0
LED_SMD_0402 = smd 0.5 x 0.5: A -0.45,0; C 0.45,0.001
WS2815 = smd 1.5 x 1: 1 -2.45,1.6; 2 -2.45,0; 3 -2.45,-1.6; 4 2.45,-1.6; 5 2.45,0; 6 2.45,1.6
RES0402 = smd 0.5 x 0.5: 1 -0.45,0; 2 0.45,0
RES0603 = smd 0.95 x 1: 1 -0.821,0.002; 2 0.822,0
RES0805 = smd 1 x 1.3: 1 -0.9,0; 2 0.9,0
SWITCH_SMD_PBUTTON_2P = smd 1.5 x 1: 1 -3.75,0; 2 3.75,0
TO252 = smd 1 x 1.6: 1 -2.28,-4.8; 2 2.28,-4.8 | smd 5.4 x 6.2: 3 0,2.5
SOT223 = smd 1.219 x 2.235: 1 -2.311,-3.1; 2 0,-3.1; 3 2.311,-3.099 | smd 3.607 x 2.184: 4 0,3.099
PFET_SOT23 = smd 1 x 1.4: 1 -0.95,-1.1; 2 0.95,-1.1; 3 0,1.1
NFET_SOT23 = smd 1 x 1.4: D 0,1.1; G -0.95,-1.1; S 0.95,-1.1
CAP_TOUCH_ROUND_10MM_SINGLE = smd 1 x 1: 1 0,0; 2 0,6
MSOP-12_GND = smd 0.9 x 0.4: 1 -2.1,1.625; 2 -2.1,0.975; 3 -2.1,0.325; 4 -2.1,-0.325; 5 -2.1,-0.975; 6 -2.1,-1.625; 7 2.1,-1.625; 8 2.1,-0.975; 9 2.1,-0.325; 10 2.1,0.325; 11 2.1,0.975; 12 2.1,1.625 | smd 1.65 x 2.85: 13 0,0
SOT23-6 = smd 0.62 x 1.22: 1 -0.95,-1.4; 2 0,-1.4; 3 0.95,-1.4; 4 0.95,1.4; 5 0,1.4; 6 -0.95,1.4
LQFP48 = smd 0.28 x 1.5: 1 -2.75,-4.4; 2 -2.25,-4.4; 3 -1.75,-4.4; 4 -1.25,-4.4; 5 -0.75,-4.4; 6 -0.25,-4.4; 7 0.25,-4.4; 8 0.75,-4.4; 9 1.25,-4.4; 10 1.75,-4.4; 11 2.25,-4.4; 12 2.75,-4.4; 25 2.75,4.4; 26 2.25,4.4; 27 1.75,4.4; 28 1.25,4.4; 29 0.75,4.4; 30 0.25,4.4; 31 -0.25,4.4; 32 -0.75,4.4; 33 -1.25,4.4; 34 -1.75,4.4; 35 -2.25,4.4; 36 -2.75,4.4 | smd 1.5 x 0.28: 13 4.4,-2.75; 14 4.4,-2.25; 15 4.4,-1.75; 16 4.4,-1.25; 17 4.4,-0.75; 18 4.4,-0.25; 19 4.4,0.25; 20 4.4,0.75; 21 4.4,1.25; 22 4.4,1.75; 23 4.4,2.25; 24 4.4,2.75; 37 -4.4,2.75; 38 -4.4,2.25; 39 -4.4,1.75; 40 -4.4,1.25; 41 -4.4,0.75; 42 -4.4,0.25; 43 -4.4,-0.25; 44 -4.4,-0.75; 45 -4.4,-1.25; 46 -4.4,-1.75; 47 -4.4,-2.25; 48 -4.4,-2.75
ESP32-WROOM-32UE = smd 1.5 x 0.9: 1 -9,7.7; 2 -9,6.43; 3 -9,5.16; 4 -9,3.89; 5 -9,2.62; 6 -9,1.35; 7 -9,0.08; 8 -9,-1.19; 9 -9,-2.46; 10 -9,-3.73; 11 -9,-5; 12 -9,-6.27; 13 -9,-7.54; 14 -9,-8.81; 25 9,-8.81; 26 9,-7.54; 27 9,-6.27; 28 9,-5; 29 9,-3.73; 30 9,-2.46; 31 9,-1.19; 32 9,0.08; 33 9,1.35; 34 9,2.62; 35 9,3.89; 36 9,5.16; 37 9,6.43; 38 9,7.7 | smd 0.9 x 1.5: 15 -5.715,-10.3; 16 -4.445,-10.3; 17 -3.175,-10.3; 18 -1.905,-10.3; 19 -0.635,-10.3; 20 0.635,-10.3; 21 1.905,-10.3; 22 3.175,-10.3; 23 4.445,-10.3; 24 5.715,-10.3 | smd 4 x 4: GND -1.5,-0.25
MSOP8 = smd 0.4 x 1.1: 1 -0.975,-2.1; 2 -0.325,-2.1; 3 0.325,-2.1; 4 0.975,-2.1; 5 0.975,2.1; 6 0.325,2.1; 7 -0.325,2.1; 8 -0.975,2.1
SOT23-5 = smd 0.62 x 1.22: 1 -0.95,-1.4; 2 0,-1.4; 3 0.95,-1.4; 4 0.95,1.4; 5 -0.95,1.4
SOT553-5 = smd 0.3 x 0.67: 1 -0.5,-0.74; 2 0,-0.74; 3 0.5,-0.74; 4 0.5,0.74; 5 -0.5,0.74
EC_MOUSEBITES = hole 0.35: 0,0; 0,-0.75; 0,-1.5; 0,0.75; 0,1.5; 0,2.25; 0,-2.25
EC_TOOL-REGISTRATION = hole 3: 0,0
ZENER_SOD323 = smd 1 x 0.6: A 1.1,0; C -1.1,0
ZENER_SOD80 = smd 1.4 x 1.8: 1 -1.7,0; 2 1.7,0

### Placement (x,y rotation side)
BLOADER  74.4,63.4 0 top
C01A  3.75,32.1 0 bottom
C01B  17.7,30.7 270 top
C01I  14.55,7.5 180 bottom
C01O  12.75,38.15 0 top
C01R  4.2,49.65 180 top
C01S  3.75,28.8 0 bottom
C01SD  15.2,43.25 0 top
C02C  14.55,66.45 0 bottom
C02I  13.5,32.25 0 top
C02O  12.75,36.45 0 top
C02R  4.05,61.65 0 top
C03R  109.9,6.75 270 top
C04R  99.15,5.25 90 top
C10D  91.5,32.95 270 top
C10R  96.45,43.9 90 top
C11D  100,32.66 0 top
C12D  100.25,41.05 90 top
C14A  95.55,43.9 90 top
C20W  48.35,71.25 180 top
C21W  47.85,72.7 180 top
C30A  50.25,8.7 180 top
C30D  50.25,15 0 top
C30I  70.05,12 180 top
C30P  70.2,7.2 0 top
C30R  61.35,6.75 0 top
C31A  48.75,10.05 0 top
C31D  50.25,21 0 top
C31R  62.85,6.75 180 top
C32A  48.75,16.05 0 top
C50D  102,13.35 270 top
C50L  112.75,11.75 0 top
C50P  23.85,6.4 90 bottom
C50S  27.45,8.55 90 top
C51L  112.75,26.75 0 top
C51P  34.05,6.4 90 bottom
C51S  37.5,8.55 90 top
C52L  112.75,44.6 0 top
C53L  112.75,61.1 0 top
CS1  102.15,35.8 0 top
CS2  93.15,30.9 270 top
D01  19.5,30.9 270 top
D01I  12.75,12.75 90 bottom
D02  12.45,34.2 180 top
D10P  118.5,22.5 180 bottom
D10U  118.5,47.6 180 bottom
D11P  118.5,24.5 180 bottom
D11U  118.5,49.6 180 bottom
D20  75.75,67 180 bottom
D21  75.75,69 180 bottom
D50  26.4,1.5 180 bottom
D50S  25.45,6.75 180 top
D51  36.6,1.5 180 bottom
D51S  35.5,6.75 180 top
DIS20  60,37.05 0 top
F20S  3,43.95 90 top
GND1  93.45,4.4 180 top
GND2  4.8,18 270 top
GRN  102,44.55 270 top
H1  4,4 0 top
H2  4,70 0 top
H3  116,4 0 top
H4  116,70 0 top
J01I  14.55,4.35 0 top
J01O  14.55,69.6 180 top
J10P  116.88,24.5 90 top
J10U  116.88,49.6 90 top
J20T  117.3,37.05 90 top
J20W  73.8,69 90 top
J21T  127.75,37.05 90 top
J30E  69.6,3.3 0 top
J30P  49.5,4.35 0 top
J30S  84.15,3.3 0 top
J50  26.4,3.3 0 top
J50L  3,37.05 270 top
J51  36.6,3.3 0 top
L01P  18.15,37.2 90 top
L10A  94.65,43.9 270 top
L30D  48.75,15 0 top
L30P  68.4,7.2 0 top
L31D  48.75,21 0 top
LD01  10.8,27.75 0 top
LD02  10.8,28.55 0 top
LD10-R  103.95,47.7 90 top
LD11-G  102,47.7 90 top
LD20  71.35,59.8 180 top
LD21  71.3,58.55 180 top
LD22  71.35,61.05 0 top
LD50  108.6,13.35 180 top
LD50R  28.2,13.8 180 top
LD51  108.6,28.35 180 top
LD51R  38.4,13.8 180 top
LD52  108.6,46.2 180 top
LD53  108.6,62.7 180 top
R01A  5.65,31.2 180 bottom
R01E  10.85,29.35 180 top
R01FB  18.2,28.5 90 top
R01I  11.3,30.55 90 top
R01L  9.3,27.75 0 top
R01R  109.75,4.05 270 top
R01S  5.65,29.7 180 bottom
R01SNS  12.75,40.1 0 top
R01T  12.45,25.95 270 top
R02A  3.75,31.2 180 bottom
R02FB  18.2,27 90 top
R02I  10.4,30.55 270 top
R02L  9.3,28.55 0 top
R02R  109.75,2.55 270 top
R02S  3.75,29.7 180 bottom
R02SNS  11.9,45.25 90 top
R03FB  17.5,27 270 top
R10L  103.95,46.2 90 top
R11L  102,46.2 90 top
R20B  70.75,56 0 top
R20E  49,70 180 top
R20L  72.9,59.8 180 top
R20P  49.4,55.95 180 top
R20R  38.5,29.45 0 top
R20S  113.55,32.6 0 top
R21B  65.7,52.75 270 top
R21L  72.9,58.55 180 top
R21S  113.55,35.15 0 top
R22L  72.9,61.05 180 top
R22S  113.55,37.65 0 top
R23S  113.55,40.2 0 top
R30A  48.75,8.7 0 top
R30B  72.95,9.3 180 top
R30C  66.3,7.2 180 top
R30F  65.75,9.35 270 top
R30I  68.55,11.25 0 top
R30O  72.95,8.35 180 top
R30P  80.35,10.95 0 top
R30S  82.85,7.15 270 top
R31A  48.75,10.8 180 top
R31B  72.95,10.2 0 top
R31I  70.05,11.25 0 top
R32A  50.25,10.8 0 top
R33A  48.75,16.8 180 top
R34A  50.25,16.8 0 top
R50L  29.7,13.8 180 top
R50S  26.55,8.55 270 top
R51L  39.9,13.8 180 top
R51S  25.65,8.55 270 top
R52S  36.6,8.55 270 top
R53S  35.7,8.55 270 top
RED  103.95,44.55 270 top
RESET  95.9,46.95 180 top
RG01  4.05,54.45 0 top
RG02  104.7,5.25 90 top
T30P  80.35,8.7 180 top
T50P  28.95,11.25 180 top
T51P  39.15,11.25 180 top
TOUCH1  133,7 90 bottom
TOUCH2  133,27 90 bottom
TOUCH3  133,47 90 bottom
TOUCH4  133,67 90 bottom
U01  14.55,29.25 0 top
U01S  15.2,45.25 90 top
U10  95.9,37.05 180 top
U20W  60,64.8 0 top
U30A  49.5,12.9 270 top
U30E  69.3,9.3 90 top
U30R  62.1,9.6 180 top
U31A  49.5,18.9 270 top
U50L  103.35,13.35 0 top
U$132  [EC_MOUSEBITES]  100.15,74 90 top
U$133  [EC_MOUSEBITES]  60,74 90 top
U$134  [EC_MOUSEBITES]  20.15,74 90 top
U$136  [EC_TOOL-REGISTRATION]  95,78.55 90 top
U$137  [EC_TOOL-REGISTRATION]  25,78.55 90 top
WRESET  41.25,66.3 180 top
Z01  19.5,27.6 90 top
Z30  65.85,6.75 270 bottom
Z31  70.9,6.75 270 bottom
Z32  73.4,6.75 270 bottom
Z50  28.95,6.6 270 bottom
Z50S  23.7,10.05 270 top
Z51  39.15,6.6 270 bottom
Z51S  33.9,10.05 270 top

### Tracks (layer width: path | path; a pad name or v marks a point on that pad's centre or on a via)
!OLED_RESET
  Top 0.4: R20R.2 40.25,29.45 DIS20.7
!RST
  Top 0.15: C10R.1 97.3,43.45 97.8,43.95 97.8,46.35 98.4,46.95 RESET.1
  Top 0.2: U10.7 95.65,42.55 96.45,43.35 C10R.1
!SHT_PWR  (via drill 0.2 pad 0.4)
  Top 0.15: U10.31 96.15,15.75 v90.15,9.75 | 81.35,9.75 T30P.1
  Top 0.4: R30P.2 80.8,10.3 T30P.1 | v82.05,9.75 81.35,9.75
  Bottom 0.15: v82.05,9.75 v90.15,9.75
!SOL_CHRG  (via drill 0.2 pad 0.4)
  Top 0.15: U01.4 v13,28.93 | v91.8,44.1 89.25,46.65 61.8,46.65 39.2,24.05 v12.3,24.05 | U10.46 99.2,38.8 v99.15,38.85 | 13,28.9 11.9,28.9 11.55,28.55 LD02.C
  Top 0.4: U01.4 12.98,28.93 13,28.9
  Route15 0.15: v12.3,24.05 12.3,28.23 v13,28.93 | v91.8,44.1 96.9,44.1 99.15,41.85 v99.15,38.85
!SOL_FAULT
  Top 0.15: U01.5 11.92,28.27 11.55,27.9 11.4,27.9 LD01.C
ACCU
  Top 0.15: 11.9,47.1 11.9,48.55 11.7,48.75
  Top 0.5: U01S.4 11.95,46.2 R02SNS.2
  Top 1: R02SNS.2 11.9,47.1 11.9,62.9 16.3,67.3 J01O.1
  Bottom 0.4: 16.75,70.05 J01O.1
  Bottom 1: C02C.1 16.35,69.55 J01O.1
  pour Top (no thermals): 11.25,45.9 11.25,63.75 14.85,67.35 14.85,70.95 15.15,71.25 17.4,71.25 17.7,70.95 17.7,49.8 14.4,46.5 14.4,45.9
B0  (via drill 0.2 pad 0.4)
  Top 0.15: TOUCH1.1 130.53,9.47 130.08,9.92 124.83,15.17 J21T.1 J20T.1 R20S.2
  other vias: 133,7
B1  (via drill 0.2 pad 0.4)
  Top 0.15: R21S.2 J20T.3 J21T.3 132.25,35.15 133,34.4 TOUCH2.1
  other vias: 133,27
B2  (via drill 0.2 pad 0.4)
  Top 0.15: TOUCH3.1 133.05,46.95 133.05,38.4 132.33,37.69 J21T.5 J20T.5 118.53,37.65 R22S.2
  other vias: 133,47
B3  (via drill 0.2 pad 0.4)
  Top 0.15: TOUCH4.1 130.43,64.42 130.08,64.08 124.83,58.83 J21T.7 J20T.7 118.55,40.2 R23S.2
  other vias: 133,67
BOOST
  Top 0.15: C01B.2 18.7,30.25 18.9,30.45 18.9,31.2 19.5,31.8 D01.C
  Top 0.3: U01.11 17.67,30.23 C01B.2
BUTTON0
  Top 0.15: U10.41 109.05,36.3 112.75,32.6 R20S.1
BUTTON1
  Top 0.15: U10.42 110.05,36.8 111.7,35.15 R21S.1
BUTTON2
  Top 0.15: U10.43 110.05,37.3 110.4,37.65 R22S.1
BUTTON3  (via drill 0.2 pad 0.4)
  Top 0.15: 104.38,40.23 v104.4,40.25 104.45,40.2 R23S.1 | U10.26 93.65,34 v93.6,34.05
  Bottom 0.15: v93.6,34.05 94.05,34.5 102.6,34.5 104.4,36.3 v104.4,40.25
CSAMPLE
  Top 0.15: U10.40 CS1.1
CSAMPLE1
  Top 0.15: U10.25 CS2.1
DI
  Top 0.3: LD50.4 104.35,14.95 103.85,14.45 U50L.4
EC
  Top 0.15: U10.11 93.65,42.4 93.45,42.6 82.65,42.6 64.95,24.9 64.95,9.33 R30F.2
  Top 0.3: U30E.7 66.2,8.97 R30F.2
EC30_BUF
  Top 0.3: U30E.2 U30E.1 71.42,8.35 R30O.2
EC_DAC
  Top 0.15: U10.14 85.05,39.3 72.5,26.75 R31B.1
  Top 0.3: R31B.1 72.5,9.6 | 72.5,9.6 R30B.2 | U30E.3 72.47,9.62 72.5,9.6
EC_IN  (via drill 0.2 pad 0.4)
  Top 0.3: v68.1,9.6 68.08,9.62 U30E.6 66.3,9.62 R30F.1
  Route15 0.15: v68.1,9.6 68.1,6.07 J30E.3
  Bottom 1: Z31.2 70.9,3.33 J30E.3
EC_NTC  (via drill 0.2 pad 0.4)
  Top 0.15: U10.16 86.6,38.3 v84.75,36.45 | v71.7,36.45 64.35,29.1 64.35,7.65 64.8,7.2 R30C.2
  Top 0.3: R30C.2 65.85,3.36 J30E.1
  Bottom 0.15: v84.75,36.45 v71.7,36.45
  Bottom 1: Z30.2 65.85,3.36 J30E.1
EC_OUT
  Top 0.3: R30O.1 J30E.4
  Bottom 1: Z32.2 J30E.4
ESP_RXD
  Top 0.4: U20W.34 73.38,67.42 J20W.1
  Bottom 0.4: D20.C J20W.1
ESP_TXD
  Top 0.4: U20W.35 73.49,68.69 J20W.2
  Bottom 0.4: D21.C J20W.2
FB1
  Top 0.4: R01R.2 R02R.1 107.86,3 RG02.1
GND  (via drill 0.2 pad 0.4)
  Top 0.15: 130.53,41.5 J21T.8
  Top 0.4: v129.4,38.9 130.62,38.9 J21T.6 | 130.39,36.4 130.66,36.4 J21T.4 | v129.4,33.85 130.65,33.85 J21T.2
  Top 0.5: 130.39,36.4 v129.4,36.4 | 130.53,41.5 v129.4,41.5
  Bottom 0.4: v129.4,41.5 J20T.8
  Bottom 1: C01I.2 16.35,4.35 | C02C.2 12.75,69.6
  other vias: 100.95,32.65 100.25,42 96.6,36.3 96.6,37.8 91.45,32 95.2,36.3 95.15,37.75 95.55,44.85 96.45,44.85 16.1,43.25 92.85,34.8 98.15,34 101.4,39.3 99,37.65 102.95,48.25 105.15,46.2 105.15,28.35 105.15,13.35 110.65,5.95 109.75,1.6 105.15,62.65 70,72.5 50,72.5 54.3,53.5 1.75,48.6 1.75,50.7 1,50.15 1,49.3 2.6,49.65 4.45,61.3 4.45,62 27.25,12.4 37.45,12.3 27.25,13.8 37.45,13.8 47.2,12.9 47.25,18.9 51.2,21 51.2,16.8 51.2,15 51.2,10.8 51.2,8.7 62.1,10.1 70.6,10.25 73.9,10.7 98.8,7.8 99.55,7.8 14.55,29.25 13.95,29.25 15.15,29.25 14.55,27.75 14.55,30.75 13.95,30.75 15.15,30.75 13.95,27.75 15.15,27.75 38.5,66.3 54.3,55.5 52,72.5 68,72.5 65.7,51.8 48.45,55.95 46.2,72.7 47.7,72.7 47.4,71.25 10.65,34.2 15.15,32.55 15.15,31.95 13.45,38.15 13.45,36.45 17.45,44.3 2.8,32.1 2.8,28.8 13,27.05 18.2,26.05 10.4,31.5 23.7,12.7 33.95,12.7
  pour Top (rank 6): 120,74 120,0 0,0 0,74
  pour Bottom (rank 6): 120,74 120,0 0,0 0,74
  pour Route15 (rank 3): 120,74 120,0 0,0 0,74
  pour Bottom: 120.05,0 120.05,74 143,74 143,0
IACCU  (via drill 0.2 pad 0.4)
  Top 0.15: v87,35.85 87.95,36.8 U10.19
  Top 0.4: U01S.3 v17.4,46.2
  Bottom 0.15: v87,35.85 31.95,35.85 21.6,46.2 17.7,46.2 v17.4,46.2
IMUXF
  Top 0.2: U30A.3 47.8,11.95 47.1,11.25 47.1,9.75 47.4,9.45 48.45,9.45 R30A.2
  Top 0.4: R30A.2 C30A.2
LED_DIN  (via drill 0.2 pad 0.4)
  Top 0.15: v88.35,12.2 88.4,12.2 94.65,18.45 U10.28
  Top 0.3: U50L.2 v103.35,12
  Bottom 0.15: v103.35,12 88.55,12 v88.35,12.2
LED_GRN
  Top 0.15: U10.6 96.15,42.3 96.75,42.9 100.35,42.9 GRN.1
  Top 0.4: R11L.1 GRN.1
LED_OUT  (via drill 0.2 pad 0.4)
  Top 0.15: LD53.3 111.05,65.05 v111,65.1
  Bottom 0.15: v111,65.1 111,66.75 104.55,73.2 10.35,73.2 8.55,71.4 8.55,43.65 8.55,42.6 8.55,38.85 6.75,37.05 J50L.2
LED_RED
  Top 0.15: U10.5 96.65,42.2 96.9,42.45 101.85,42.45 RED.1
  Top 0.4: R10L.1 RED.1
N$1  (via drill 0.2 pad 0.4)
  Top 0.4: R20B.1 v69.3,56 U20W.25
  Route15 0.15: BLOADER.1 73.13,59.83 v69.3,56
N$2
  Top 0.4: LD20.A R20L.2
N$3
  Top 0.4: LD21.A R21L.2
N$4
  Top 0.2: U01.7 16.65,26.85 16.95,26.55 R03FB.2
N$5
  Top 0.4: R01L.2 LD01.A
N$6
  Top 0.2: C31D.1 49.8,20.1 50.05,19.85 U31A.6
  Top 0.4: L31D.2 C31D.1 | U31A.6 U31A.5
N$7
  Top 0.4: C50L.1 LD50.1
N$8
  Top 0.2: U30E.5 68.62,10.28 69,10.65 R30I.2
  Top 0.4: C30I.2 R31I.1 R30I.2
N$9
  Top 0.4: C51L.1 LD51.1
N$10
  Top 0.4: R02L.2 LD02.A
N$11
  Top 0.4: C52L.1 LD52.1
N$12
  Top 0.4: LD53.1 C53L.1
N$13
  Top 0.4: LD51R.A R51L.2
N$14
  Top 0.4: C50S.1 R50S.2 D50S.C
N$15
  Top 0.2: C30D.1 49.8,14.1 50.05,13.85 U30A.6
  Top 0.4: U30A.6 U30A.5 | L30D.2 C30D.1
N$16
  Top 0.4: R21B.1 65.7,54.48 U20W.24
N$17
  Top 0.4: C51S.1 R52S.2 D51S.C
N$18
  Top 0.4: R20P.1 51,55.95 U20W.14
N$20
  Top 0.2: R34A.1 49.8,17.7 50.05,17.95 U31A.4
  Top 0.4: R34A.1 R33A.1 C32A.2
N$21
  Top 0.2: R31A.2 49.05,11.55 49.05,13.65 48.85,13.85 U30A.1 47.8,13.85 47.1,14.55 47.1,17.25 47.8,17.95 U31A.3
  Top 0.4: C31A.1 R31A.2
N$22
  Top 0.2: R32A.1 49.8,11.7 50.05,11.95 U30A.4
  Top 0.4: R32A.1 R31A.1 C31A.2
N$23
  Top 0.4: R11L.2 LD11-G.A
N$24
  Top 0.4: LD22.C R22L.2
N$25
  Top 0.2: U01.6 R01T.1
N$26
  Top 0.4: D01.A Z01.A
N$27
  Top 0.15: U01.3 11.52,29.57 R01E.1
N$31
  Top 1: J50L.1 F20S.1
N$39
  Top 0.4: LD10-R.A R10L.2
N$44
  cutout Route15: 104.1,69.9 arc90 102.1,71.9 90.1,71.9 arc90 88.1,69.9 arc90 90.1,67.9 102.1,67.9 arc90
  cutout Route2: 104.1,69.9 arc90 102.1,71.9 90.1,71.9 arc90 88.1,69.9 arc90 90.1,67.9 102.1,67.9 arc90
N$46
  cutout Top: 0.15,7.1 0.15,13.85 2.7,13.85 2.7,7.1
  cutout Bottom: 0.15,7.1 0.15,13.85 2.7,13.85 2.7,7.1
  cutout Route15: 0.15,7.1 0.15,13.85 2.7,13.85 2.7,7.1
  cutout Route2: 0.15,7.1 0.15,13.85 2.7,13.85 2.7,7.1
N$70
  Top 0.4: LD50R.A R50L.2
OLED_CD  (via drill 0.2 pad 0.4)
  Top 0.15: U10.33 97.15,31.6 v97.05,31.5
  Bottom 0.15: v97.05,31.5 96.75,31.2 43.05,31.2 42.3,31.95 40.27,31.95 DIS20.6
OLED_CS  (via drill 0.2 pad 0.4)
  Top 0.15: U10.32 v96.65,33.7
  Bottom 0.15: v96.65,33.7 95.65,32.7 44.1,32.7 42.3,34.5 DIS20.5
OLED_MOSI  (via drill 0.2 pad 0.4)
  Top 0.15: U10.17 v87.6,37.8
  Bottom 0.15: DIS20.3 85.81,39.59 v87.6,37.8
OLED_SCK  (via drill 0.2 pad 0.4)
  Top 0.15: U10.15 85.85,38.8 v85.8,38.85
  Bottom 0.15: v85.8,38.85 84.75,37.8 42.9,37.8 42.15,37.05 DIS20.4
P0
  Top 0.8: T50P.D J50.3
  Bottom 0.4: J50.3 28.94,2.94 D50.A
  Bottom 1: Z50.2 J50.3
P1
  Top 0.8: T51P.D J51.3
  Bottom 0.4: J51.3 39.14,2.94 D51.A
  Bottom 1: Z51.2 J51.3
PAR
  Top 0.15: U10.10 94.15,42.5 93.6,43.05 65.4,43.05 46.8,24.45 46.8,20.1 47.05,19.85 U31A.1
  Top 0.2: R33A.2 49.05,17.55 49.05,19.65 48.85,19.85 U31A.1
  Top 0.4: C32A.1 R33A.2
PAR_IN
  Top 0.4: J30P.1 47.75,8.15 R30A.1
PUMP0  (via drill 0.2 pad 0.4)
  Top 0.15: U10.45 98.45,38.3 v98.25,38.1 | v74.7,24.75 v84,34.05
  Top 0.4: T50P.G 30.15,12.6 R50L.1 v30.15,14.3
  Bottom 0.15: v74.7,24.75 40.6,24.75 v30.15,14.3 | v98.25,38.1 98.25,36.15 97.5,35.4 92.1,35.4 90.75,34.05 v84,34.05
PUMP1  (via drill 0.2 pad 0.4)
  Top 0.15: U10.39 99.35,35.3 99.15,35.1 99.15,34.05 99.45,33.75 100.95,33.75 101.7,33 101.7,28.65 v99.45,26.4
  Top 0.4: T51P.G 40.35,12.6 R51L.1 v40.35,14.3
  Bottom 0.15: v99.45,26.4 96.6,23.55 49.6,23.55 v40.35,14.3
REF_EC  (via drill 0.2 pad 0.4)
  Top 0.15: U10.38 102.15,34.8 103.5,33.45 103.5,19.35 v102,17.85
  Top 0.4: v61.15,11.85 U30R.3
  Bottom 0.15: v102,17.85 67.15,17.85 v61.15,11.85
S0
  Top 0.4: J50.2 26.4,4.7 D50S.A
S1
  Top 0.4: J51.2 36.6,4.55 D51S.A
SENSE  (via drill 0.2 pad 0.4)
  Top 0.2: R01SNS.2 13.55,40.12
  Top 0.3: U01.10 17.33,29.57 v17.35,29.6
  Top 0.4: 13.55,40.12 v13.55,40.85
  Top 0.9: R01SNS.2 18.15,40.1 L01P.P$2
  Route15 0.15: v17.35,29.6 17.35,37.05 v13.55,40.85
  pour Top (no thermals): 13.2,39.3 13.2,41.55 13.35,41.7 20.55,41.7 20.7,41.55 20.7,39.3 20.55,39.15 13.35,39.15
SER_RXD  (via drill 0.2 pad 0.4)
  Top 0.15: U10.13 v92.6,39.8
  Bottom 0.15: v92.6,39.8 94.85,39.8 102.65,47.6 104.75,47.6 105.45,48.3 113.55,48.3 114.3,47.55 116.88,47.55 J10U.1
  Bottom 0.4: D10U.C J10U.1
SER_TXD  (via drill 0.2 pad 0.4)
  Top 0.15: U10.12 v92.7,41.45
  Bottom 0.15: J10U.2 103.15,49.6 95,41.45 v92.7,41.45
  Bottom 0.4: D11U.C J10U.2
SHT_CLK
  Top 0.15: U10.30 95.65,16.6 85.42,6.37 J30S.3
SHT_DAT
  Top 0.15: U10.29 95.15,17.6 84.25,6.7 R30S.2
  Top 0.4: R30S.2 82.85,3.33 J30S.2
SPEED0  (via drill 0.2 pad 0.4)
  Top 0.15: R51S.1 v25.65,9.45 | U10.2 98.15,40.45 v98.25,40.35
  Top 0.4: R50S.1 R51S.1 24.35,9 Z50S.2
  Route15 0.15: v25.65,9.45 25.65,16.65 33.15,24.15 68.55,24.15 84.67,40.27 85.05,40.65 86.85,42.45 96.15,42.45 v98.25,40.35
SPEED1  (via drill 0.2 pad 0.4)
  Top 0.15: U10.3 v97.65,40.05
  Top 0.4: R53S.1 R52S.1 | R53S.1 34.55,9 Z51S.2 | R53S.1 v35.7,9.45
  Route15 0.15: v97.65,40.05 97.65,39.15 97.35,38.85 91.95,38.85 69.3,16.2 38.7,16.2 35.7,13.2 v35.7,9.45
SW
  Top 0.3: U01.12 17.42,30.88 C01B.1
  Top 0.4: U01.12 16.65,33.85 16.8,33.85 | 16.8,33.85 17.8,33.85 L01P.P$1 | D02.C 16.45,34.2 16.8,33.85
  pour Top (no thermals): 16.2,30.9 16.2,32.7 15.9,33 13.5,33 13.35,33.15 13.35,35.25 13.5,35.4 20.7,35.4 20.85,35.25 20.85,33 20.7,32.85 18.9,32.85 18.6,32.55 18.6,31.5 18,30.9
SWD_CLK  (via drill 0.2 pad 0.4)
  Top 0.15: U10.37 101.45,34.3 102.3,33.45 v102.3,24.5
  Bottom 0.15: J10P.2 v102.3,24.5
  Bottom 0.4: D11P.C J10P.2
SWD_IO  (via drill 0.2 pad 0.4)
  Top 0.15: U10.34 97.65,24.75 v99.9,22.5
  Bottom 0.15: J10P.1 v99.9,22.5
  Bottom 0.4: D10P.C J10P.1
V0  (via drill 0.2 pad 0.4)
  Top 0.2: U30E.8 68.17,8.32 68.85,7.65 68.85,7.35 69,7.2
  Top 0.3: R30C.1 66.75,8.05 67,8.3 67.17,8.3 U30E.8
  Top 0.4: L30P.2 69,7.2 v69.3,7.2 C30P.1 | R30I.1 v67.6,11.25 | R30B.1 73.8,9.3 v74.05,9.55
  Route15 0.15: v67.6,11.25 69.3,11.25 | 69.3,11.25 72.4,11.25 74.05,9.6 v74.05,9.55 | v69.3,7.2 69.3,11.25
VACCU  (via drill 0.2 pad 0.4)
  Top 0.15: U10.18 92.95,37.3 v93,37.35
  Route2 0.15: v4.65,31.2 5.7,31.2 6.9,32.4 6.9,37.5 9.15,39.75 14.85,39.75 15.9,40.8 86.7,40.8 90.15,37.35 v93,37.35
  Bottom 0.4: C01A.1 R02A.2 v4.65,31.2 R01A.1 4.7,31.2
VBAT  (via drill 0.2 pad 0.4)  (1 unrouted)
  Top 0.15: R01SNS.1 11.95,40.12 | R01FB.2 18.7,28.95 18.9,28.75 18.9,27.3 19.5,26.7 Z01.C
  Top 0.3: 109.65,8.1 110.15,8.1 | R02SNS.1 11.85,44.3 | U01.9 17.33,28.93 v17.35,28.95
  Top 0.4: 11.95,40.12 v11.95,40.85 | 6.35,49.15 6.3,49.2 6.3,49.65 6.3,50.1 | v110.15,8.25 110.15,8.1 110.15,7.7 110.1,7.65 109.98,7.65 C03R.1 | 109.65,7.57 109.65,8.1 v109.65,8.25 110.1,8.25 110.1,8.2 | R01FB.2 v17.35,28.95
  Top 0.5: U01S.6 12,44.3 11.85,44.3 11.8,44.3 | LD53.2 v110.05,62.7 | LD52.2 v110.05,46.2 | LD51.2 v110.05,28.35 | LD50.2 v110.05,13.35 | v11.35,35.55 v11.85,35.55 | v12.35,35.55 v11.85,35.55 | v11.85,35.55 C02O.1
  Top 0.7: C01O.1 11.85,40.02 R01SNS.1
  Top 0.8: RG01.2 6.3,49.65 C01R.1 | 12,44.3 11.95,44.25 v11.95,40.85 11.95,40.1 R01SNS.1 | 11.8,44.3 7.6,44.3 6.35,45.55 6.3,45.55 | F20S.2 6.3,45.55 | C03R.1 RG02.3 | 6.35,49.15 6.35,45.6 6.3,45.55
  Top 0.9: C02O.1 11.85,37.2 | 11.85,37.2 C01O.1 | 11.85,37.2 | R01SNS.1
  Route15 0.15: v11.95,40.85 16.65,36.15 16.65,29.4 17.1,28.95 v17.35,28.95
  Route15 0.4: v110.15,8.25 110.05,8.35 v110.05,13.35 v110.05,28.35 v110.05,46.2 v110.05,62.7
  Route15 1: J51.1 34.06,1.36 | v110.15,8.25 v109.65,8.25 102.75,1.35 25.81,1.35 J50.1
  Bottom 0.15: 11.25,35.55 9.3,35.55 6.1,32.35 R01A.2
  Bottom 0.2: 11.25,35.55 v11.35,35.55
  Bottom 0.4: J51.1 34.06,2.94 D51.C | D50.C 25.3,1.55 23.85,3 J50.1
  Bottom 1: J51.1 C51P.1 | C50P.1 J50.1 21.9,3.3 21,4.2 21,34.8 20.25,35.55 v11.85,35.55 11.4,35.55
  pour Top (no thermals): 12.3,35.55 12.3,44.85 9.15,44.85 8.4,45.6 8.4,49.95 7.95,50.4 4.8,50.4 4.65,50.25 4.65,43.95 9,39.6 9,36.6 10.05,35.55
VCC  (via drill 0.2 pad 0.4)
  Top 0.3: U50L.5 102.29,14.09 C50D.1
  Top 0.4: R01R.1 108.55,4.5 RG02.2 | C04R.+ v99.15,4.8 | v102,14.2 C50D.1
  Top 1: RG02.2 RG02.4 101.6,4.65 100.7,3.75 C04R.+
  Route15 0.4: v102,14.2 102,7.65 v99.15,4.8
VCCA  (via drill 0.2 pad 0.4)
  Top 0.4: U30R.5 63.3,7.95 C31R.1 v63.75,6.75 | v67.5,7.2 L30P.1
  Route15 0.15: v67.5,7.2 64.2,7.2 v63.75,6.75
VDD_3V3  (via drill 0.2 pad 0.4)
  Top 0.15: 100.3,40.55 C12D.1
  Top 0.2: C11D.1 U10.36 | C10D.1 U10.24 | U10.48 100.3,40.55 | C01SD.1 14.75,44.65 14.15,45.25 U01S.5
  Top 0.4: C11D.1 v99.55,32.2 | L10A.1 v94.65,44.85 | v100.7,40.6 C12D.1 | L31D.1 v47.85,21 | L30D.1 v47.85,15 | T30P.2 79.9,10.3 R30P.1 v79.4,10.95 | U30R.4 60.9,7.95 C30R.1 v60.45,6.75 | C01SD.1 v14.3,43.25 | v1.5,62.05 2.45,62.05 2.55,61.95 C02R.+ | v1.5,61.25 2.45,61.25 2.55,61.35 | 50.98,71.25 U20W.2 48.82,71.23 | C10D.1 v91.06,33.41 v91.05,33.4 | v73.85,59.8 R20L.1 | v73.85,58.55 R21L.1 | R20B.2 v71.75,56 | R20E.2 v48.05,70 | 48.82,71.23 C20W.1 48.8,72.65 C21W.1 | 48.82,71.23 48.8,71.21 v48.8,70.8 | R02L.1 v8.35,28.55 | R01L.1 v8.35,27.75
  Top 0.5: R20R.1 v37.55,29.45
  Top 1: C02R.+ 2.55,61.35 2.55,58.45 RG01.3
  pour Route2 (rank 2): 120,0 0,0 0,74 120,74
VDDA
  Top 0.2: U10.9 L10A.2
  Top 0.4: L10A.2 C14A.1
VFB
  Top 0.4: R03FB.1 R02FB.2 R01FB.1
VGND  (via drill 0.2 pad 0.4)
  Top 0.15: U10.20 v93,36.3
  Route2 0.15: v3.3,30.45 6,30.45 7.8,32.25 7.8,37.2 9.6,39 15,39 15.75,38.25 85.95,38.25 88.05,36.15 92.85,36.15 v93,36.3
  Bottom 0.4: R02S.1 v3.3,30.45 R02A.1
VIN  (via drill 0.2 pad 0.4)
  Top 0.3: U01.1 11.42,30.88 R01I.2
  Top 0.4: U01.1 12.45,32.1 C02I.1 | R01E.2 10.1,29.35 v9.75,29.7
  Top 0.5: v11.85,31.65 v11.85,32.25 | v11.85,32.85 v11.85,32.25 | v11.85,32.25 C02I.1
  Bottom 0.15: R01S.2 v9.75,29.7 | 11.4,29.7 11.55,29.55 11.55,31.35 v11.85,31.65
  Bottom 0.4: v9.75,29.7 11.4,29.7
  pour Bottom (no thermals): 13.8,14.4 13.8,24.15 12.15,25.8 12.15,32.85 12,33 11.1,33 10.95,32.85 10.95,15.15 11.7,14.4
VIN_REG
  Top 0.3: U01.2 11.42,30.23 R01I.1
  Top 0.4: R02I.2 R01I.1
VSOL  (via drill 0.2 pad 0.4)
  Top 0.15: U10.27 94.15,33.55 v94.65,34.05
  Route2 0.15: v4.7,29.7 6.45,29.7 8.55,31.8 8.55,36.15 9.3,36.9 37.35,36.9 38.4,35.85 85.65,35.85 87.45,34.05 92.25,34.05 92.85,33.45 94.05,33.45 v94.65,34.05
  Bottom 0.4: C01S.1 R02S.2 v4.7,29.7 R01S.1
VSUN
  Top 1: 12.45,4.7 J01I.1
  Bottom 0.4: 12.35,3.9 J01I.1
  Bottom 1: C01I.1 12.8,7.5 12.8,7.35 12.75,7.4
  Bottom 1.5: 12.8,7.35 J01I.1 | D01I.A 12.75,7.4
VY
  Top 0.4: R30S.1 T30P.3
  Top 0.8: T30P.3 J30S.1
WIFI_EN  (via drill 0.2 pad 0.4)
  Top 0.15: U10.4 97.15,39.7 v96.75,39.3 | R20E.1 49.45,68.5 47.25,66.3 WRESET.1
  Top 0.4: U20W.3 50.96,70 v49.95,70 R20E.1
  Bottom 0.15: v49.95,70 70.4,70 71.85,68.55 71.85,57.45 90.6,38.7 96.15,38.7 v96.75,39.3
WIFI_LED
  Top 0.4: LD22.A 69,61.05 U20W.29
WIFI_RXD  (via drill 0.2 pad 0.4)
  Top 0.15: U10.22 90.5,35.3 90.3,35.1 90.3,34.95 v90.15,34.8
  Top 0.4: U20W.28 v70.1,59.8 LD20.C
  Bottom 0.15: v70.1,59.8 71.1,58.8 71.1,57.3 90.3,38.1 90.3,34.95 v90.15,34.8
WIFI_TXD  (via drill 0.2 pad 0.4)  (1 unrouted)
  Top 0.15: U10.21 90.25,35.8 v89.7,35.25
  Top 0.4: LD21.C v70.1,58.55 69.02,58.55 U20W.27
  Bottom 0.15: v89.7,35.25 89.7,36.75 70.2,56.25 70.2,58.45 v70.1,58.55
X0
  Top 0.15: LD50.3 111.05,19.6 108.6,22.05 108.6,27.75 106.35,30 106.2,30 LD51.4
X1  (via drill 0.2 pad 0.4)
  Top 0.15: LD51.3 111,30 | 106.5,47.7 106.25,47.7 LD52.4
  Top 0.4: 111,30 v111,30.75 | v107.55,47.1 107.1,47.1 106.5,47.7
  Bottom 0.15: v111,30.75 108.83,32.92 108.6,33.15 107.55,34.2 v107.55,47.1
X2
  Top 0.15: LD52.3 111.05,52.6 108.6,55.05 108.6,62.1 106.35,64.35 106.2,64.35 LD53.4

### Text on the board
Top: 1
Route2: 2
Route15: 3
Bottom: 4
tPlace: - | + | ACCU | OPEN : RUN | ESP32 RESET | SHORT: PROG | NFT MASTER | 221212-v1.1 | SERIAL | LEDS | TOUCH | 0R/Ctimer | DEBUG | GND | PUMP0 | PUMP1 | EC | SHT15 | SOLAR | PAR | GND | + | -
tRestrict: CADWEASEL
bRestrict: CADWEASEL